# EAGLE schematic A33 MINI TABLET (EAGLE 9.6.2)
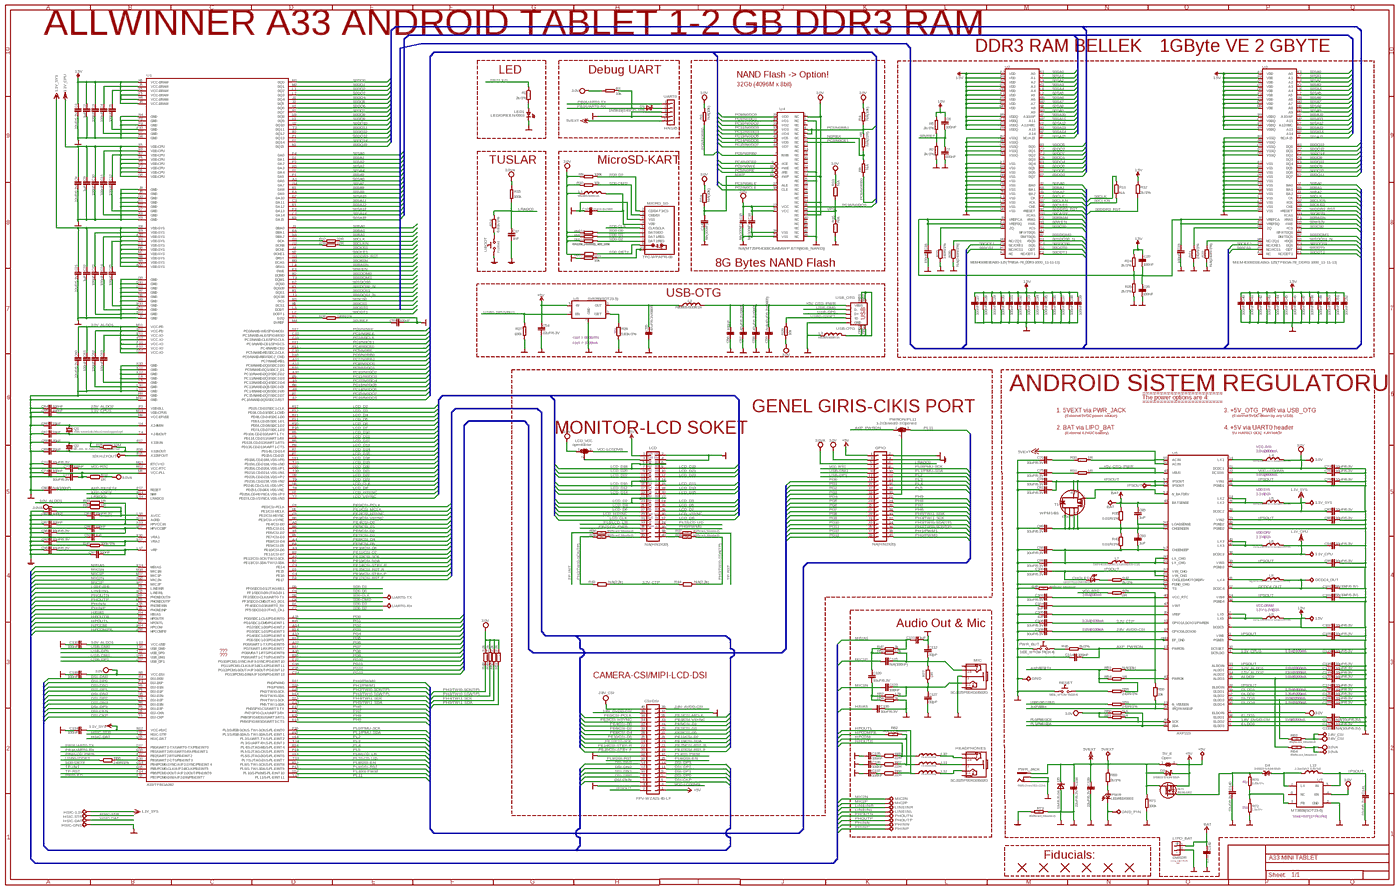
[diagram p0: schematic, sheet 1, overview]
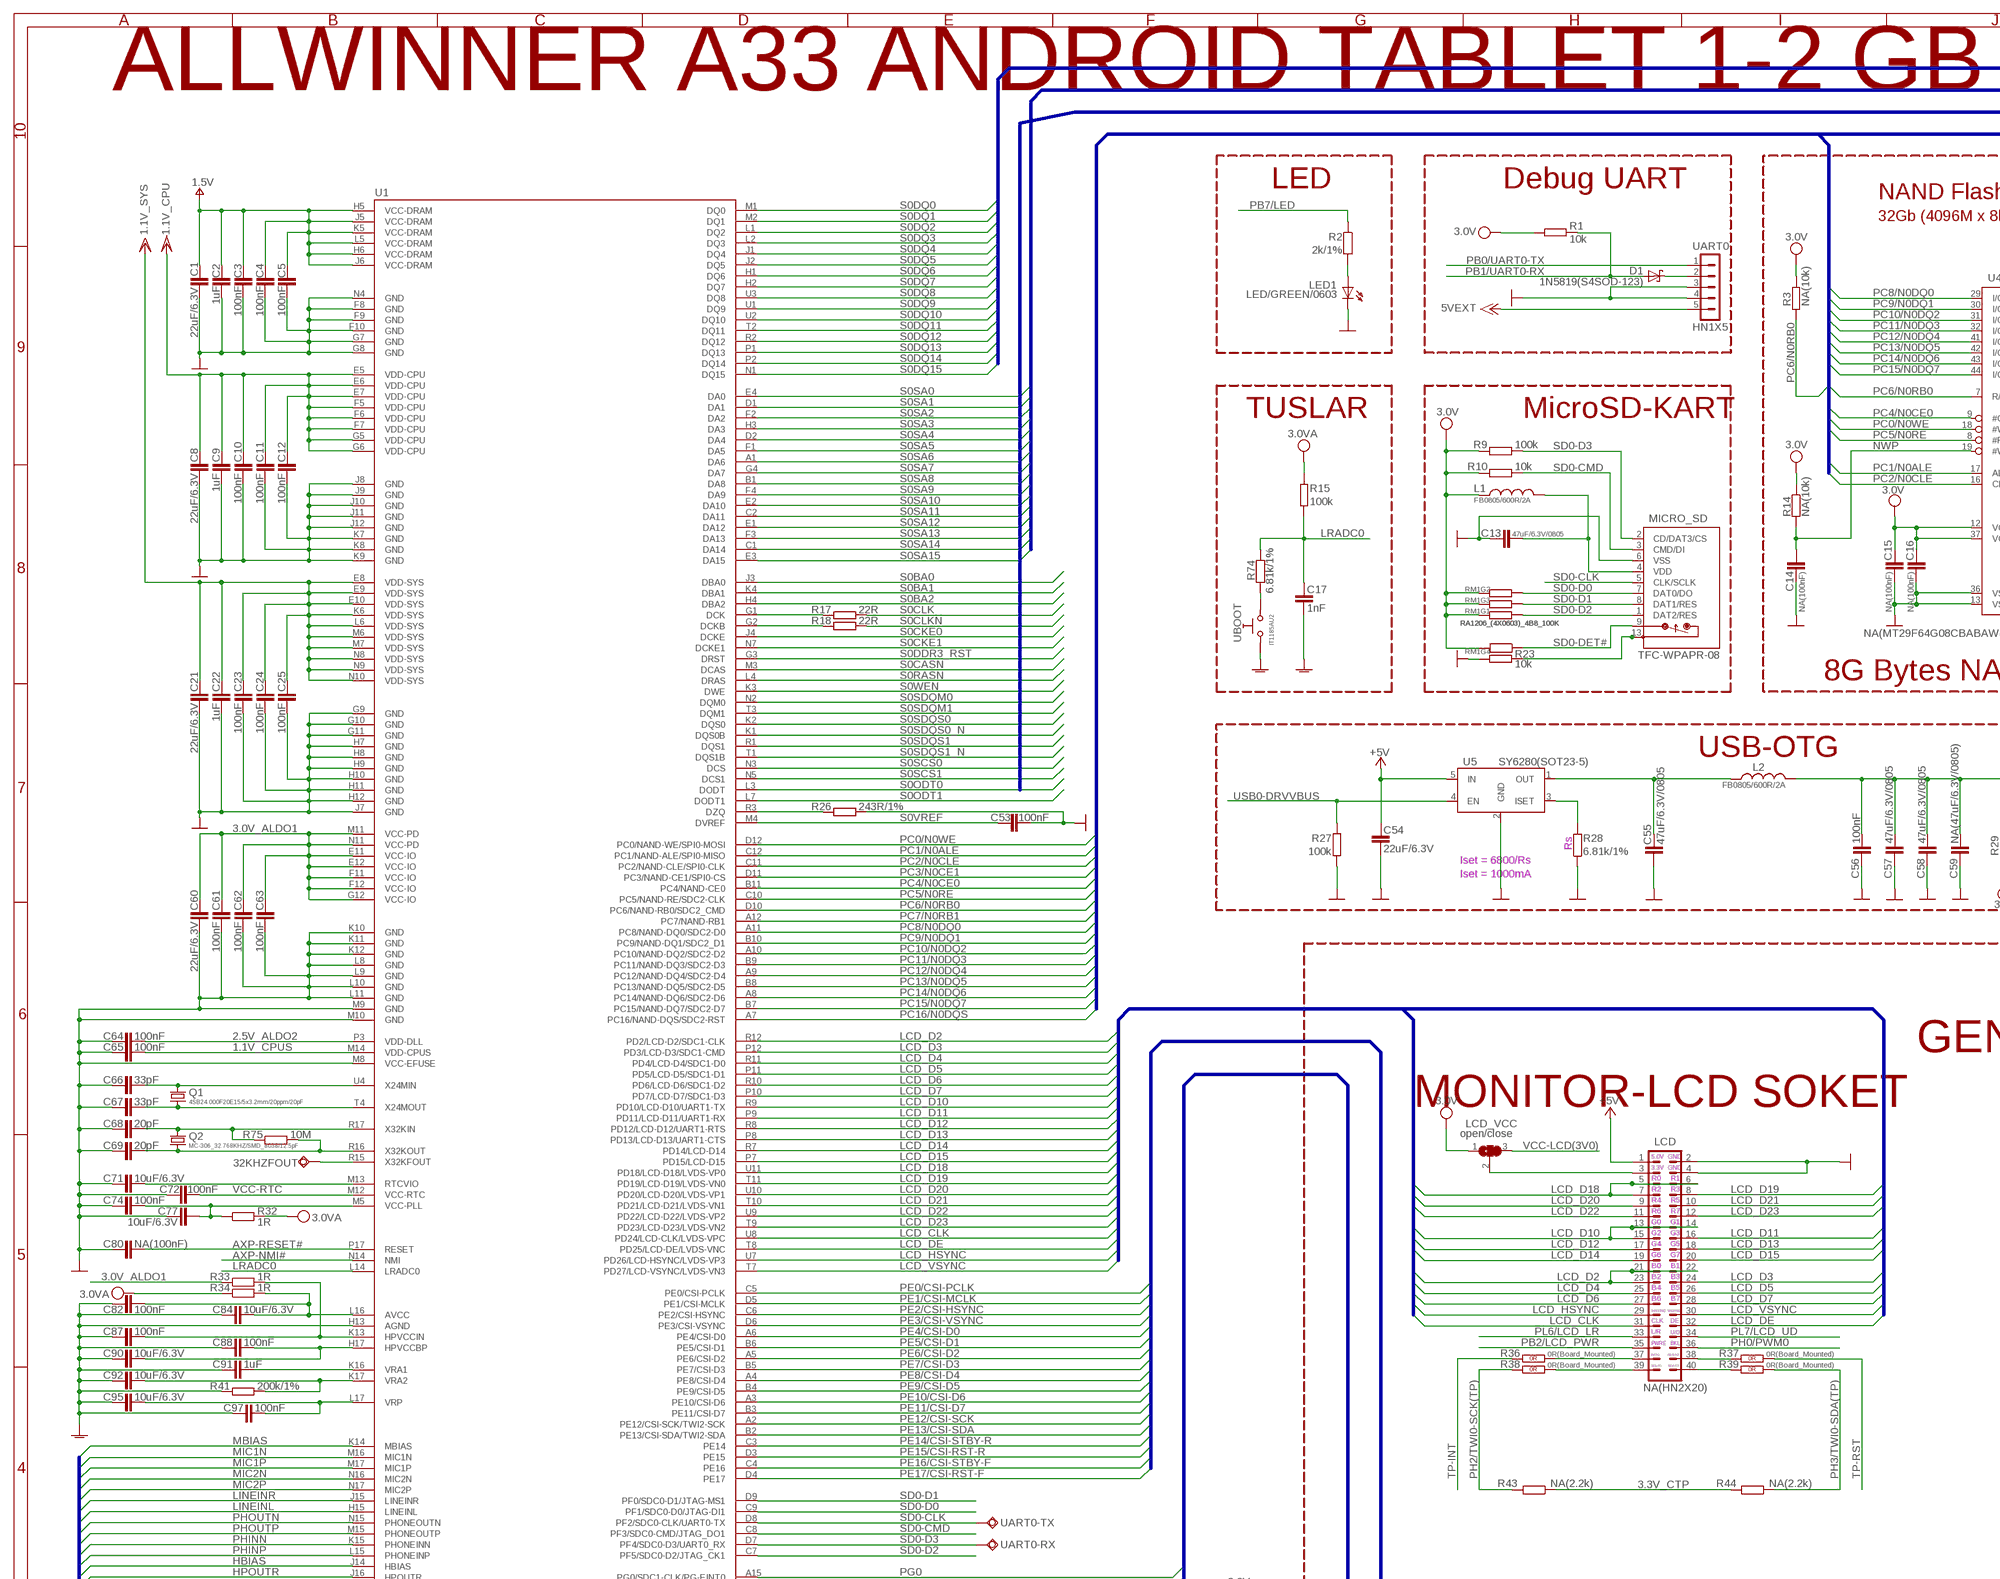
[diagram p1: schematic, sheet 1, part 1 of 4]
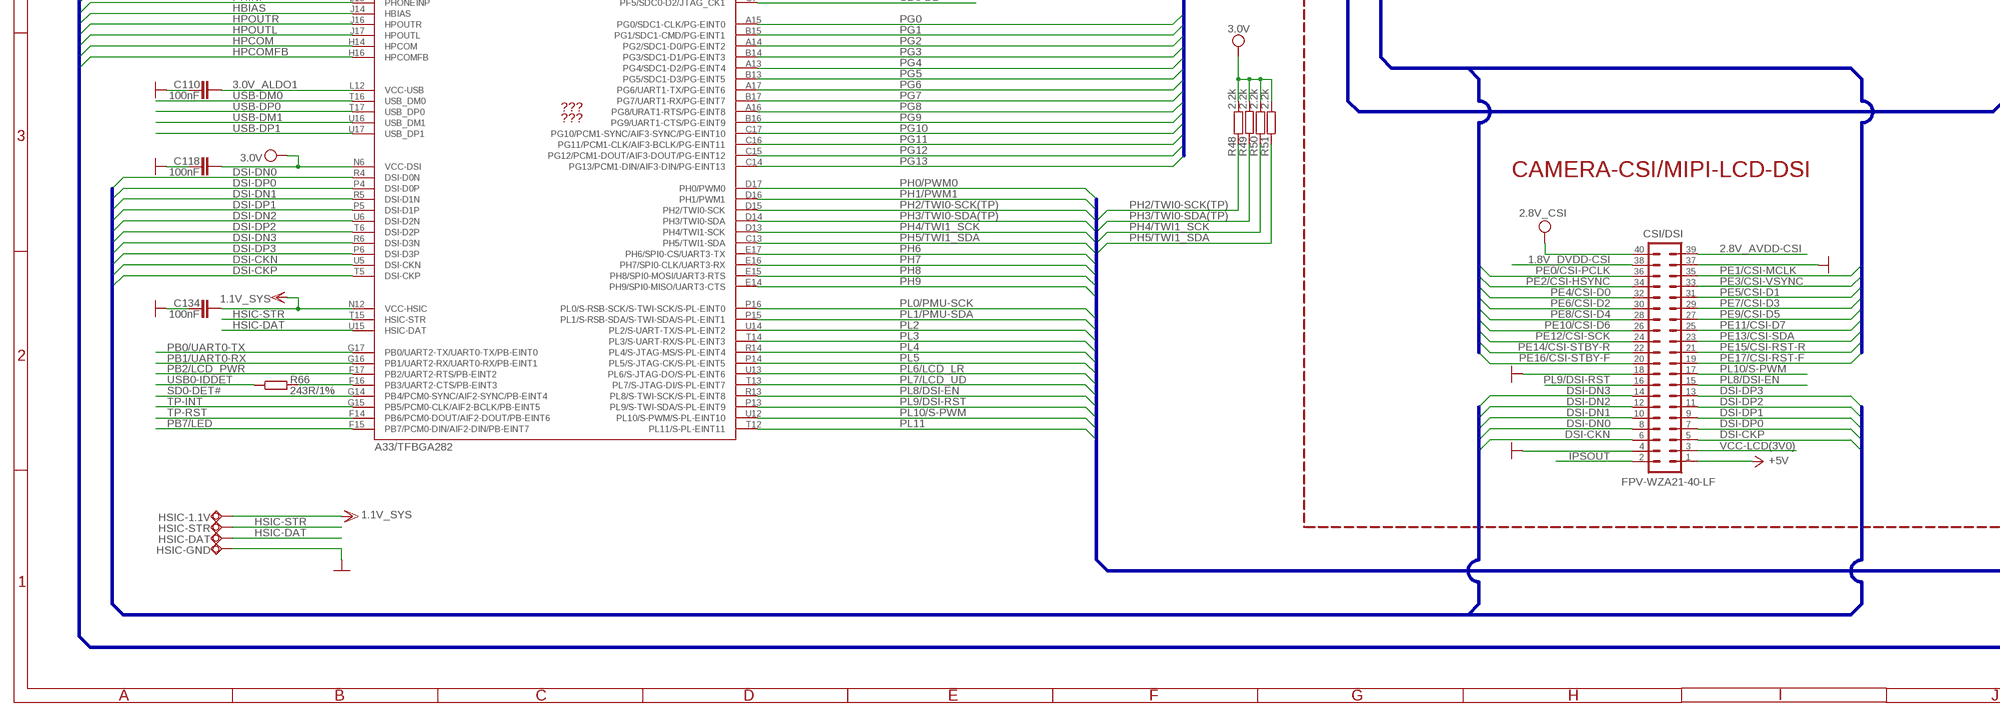
[diagram p2: schematic, sheet 1, part 2 of 4]
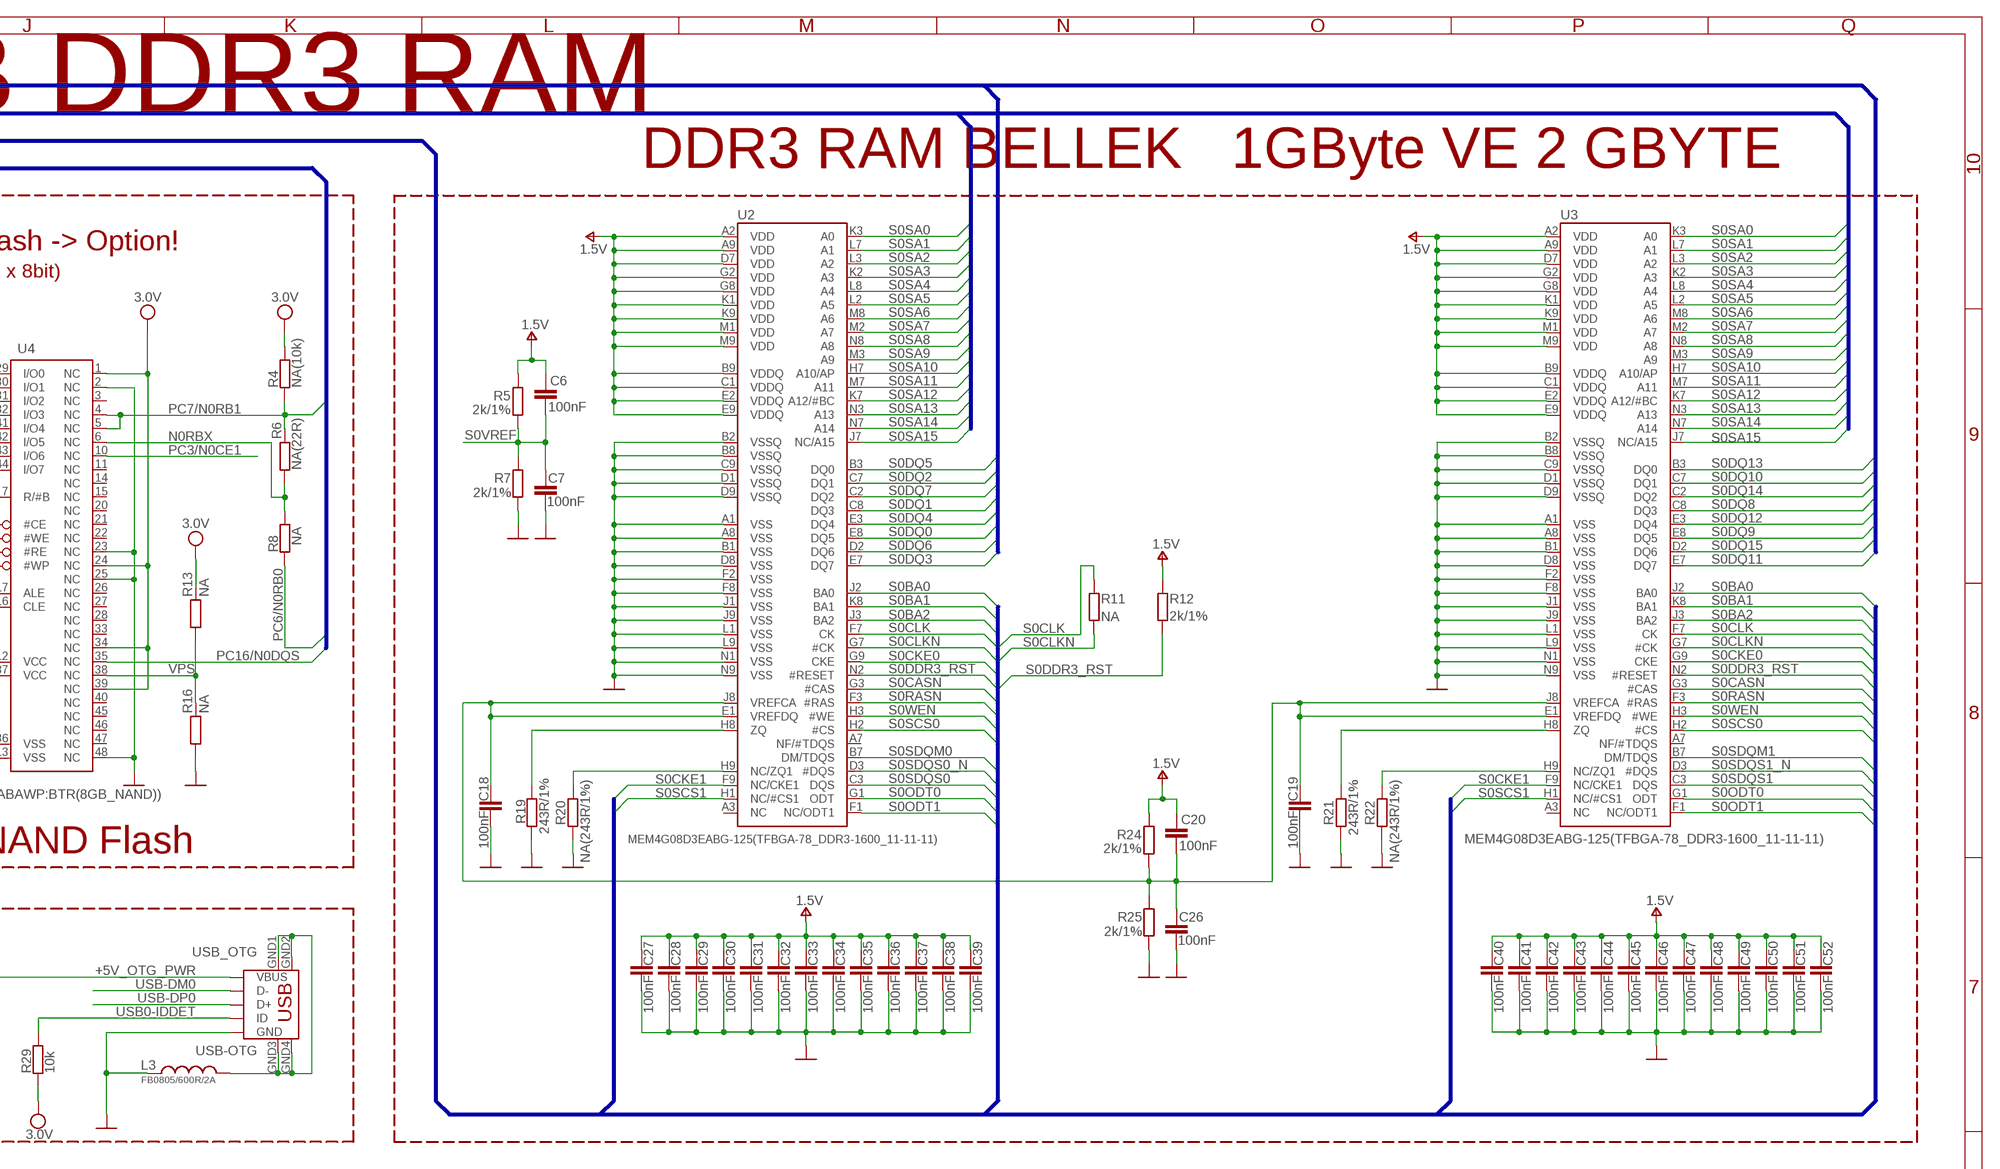
[diagram p3: schematic, sheet 1, part 3 of 4]
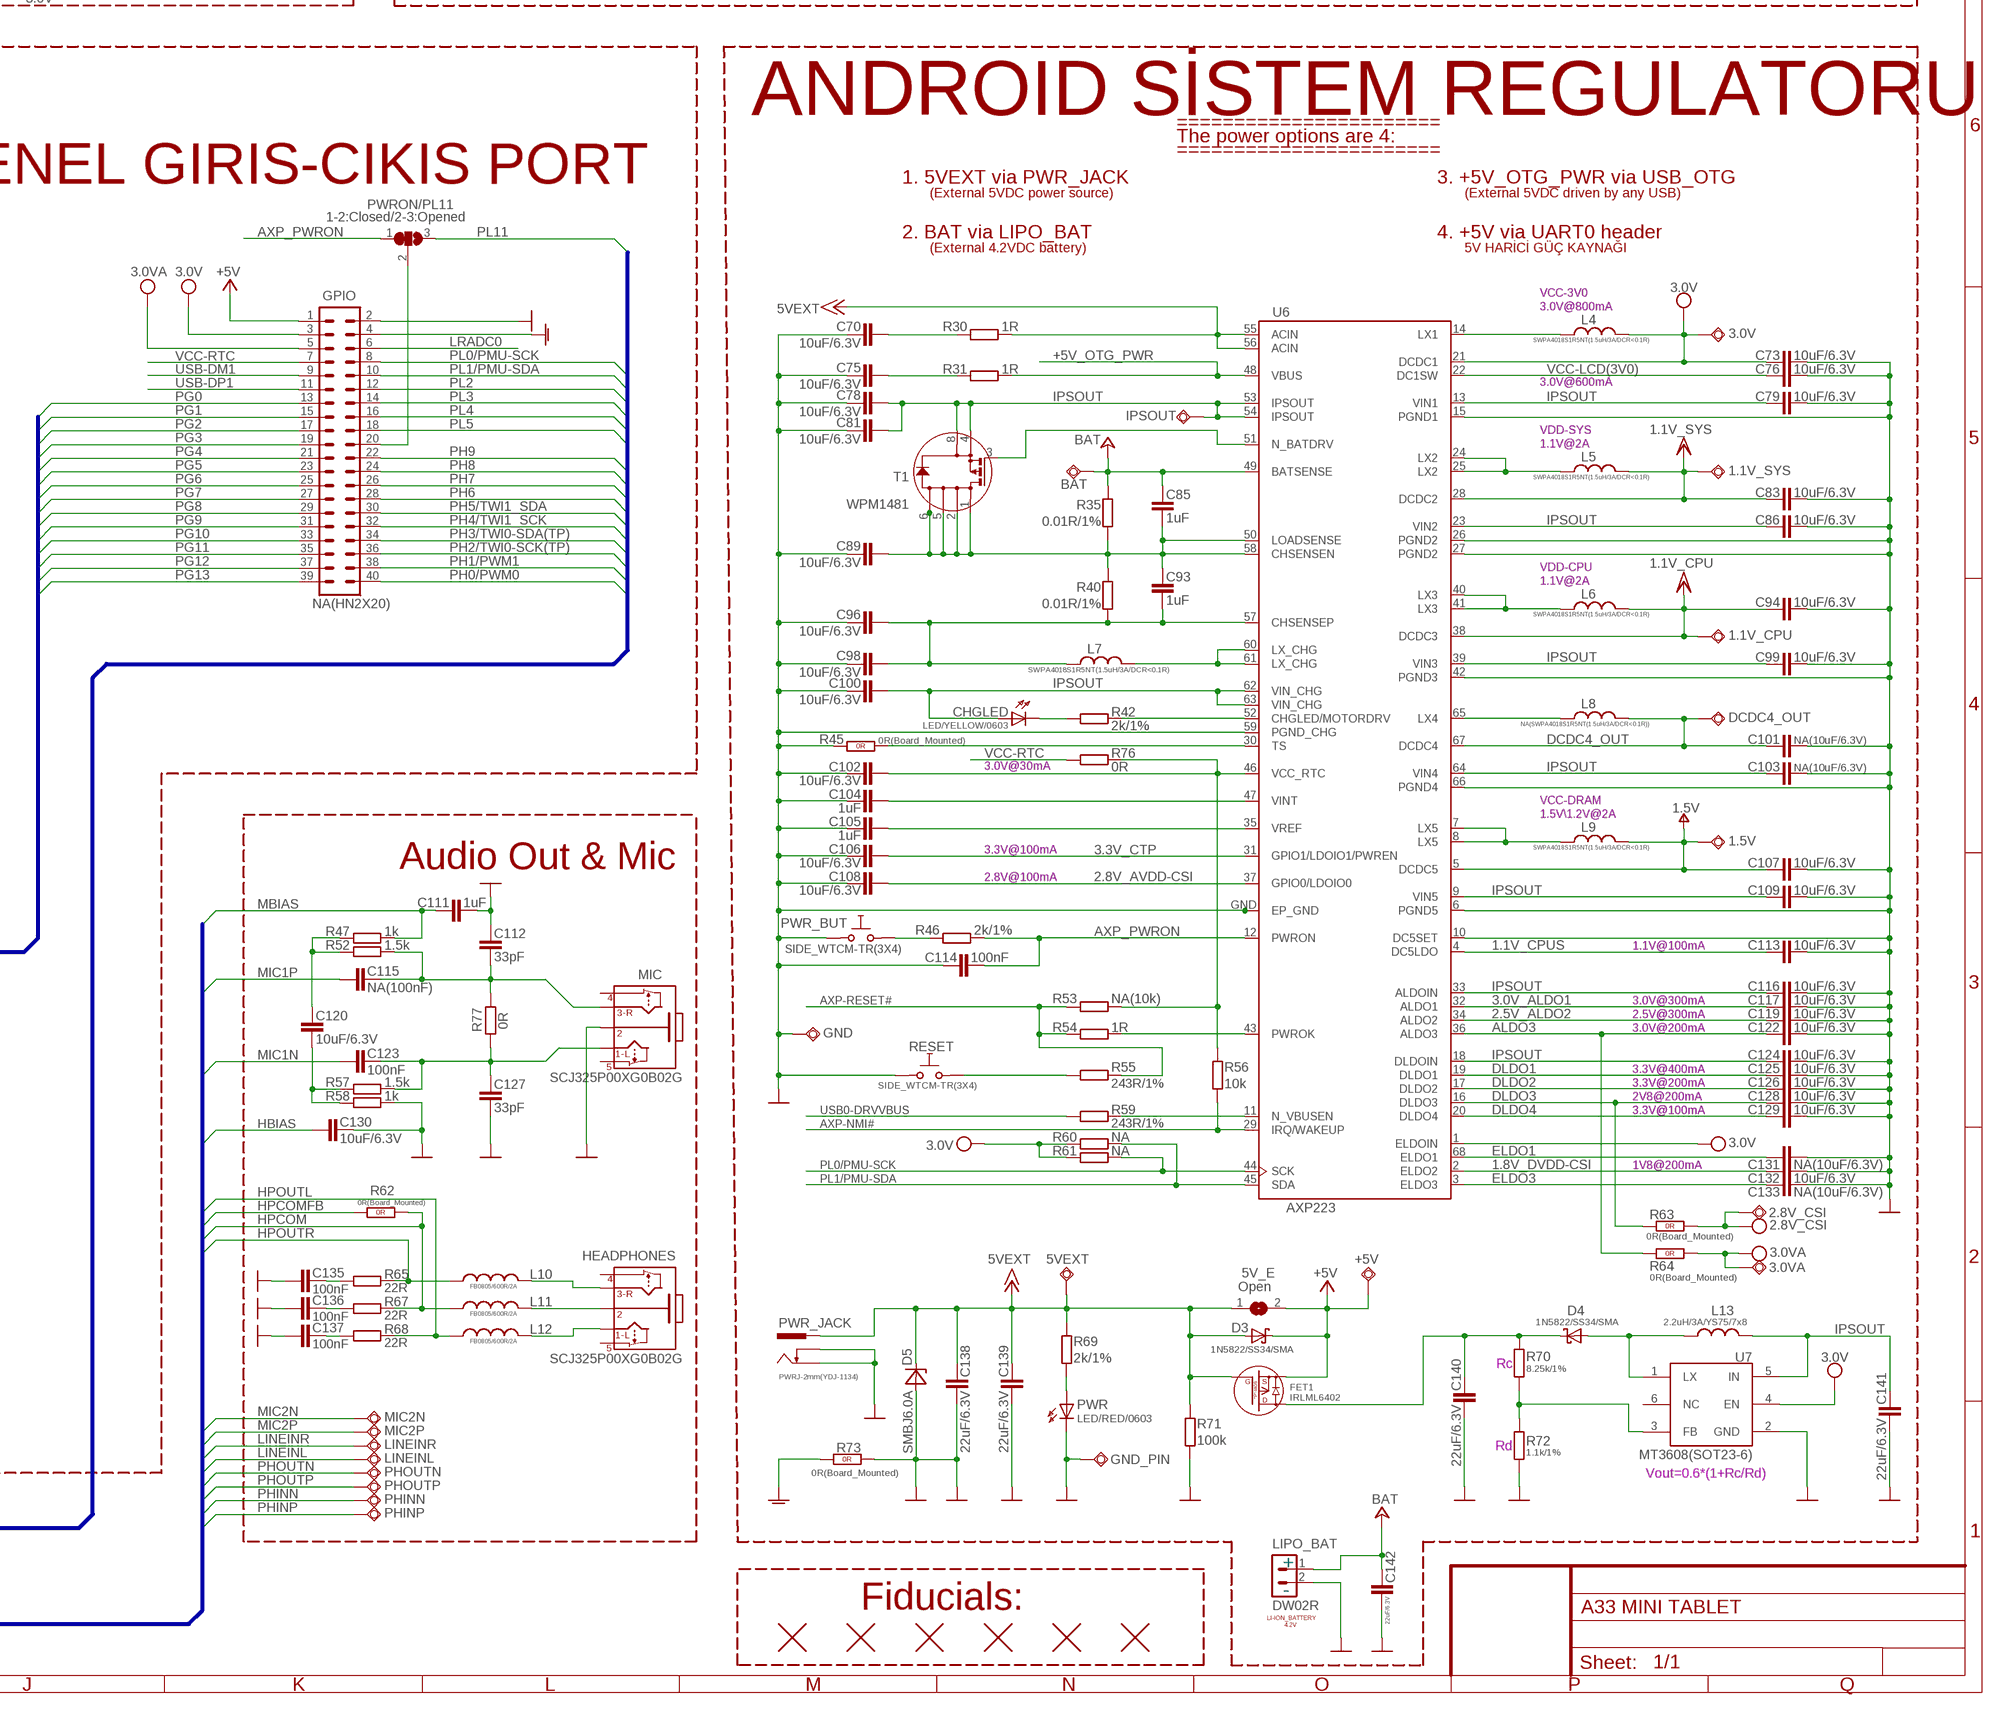
[diagram p4: schematic, sheet 1, part 4 of 4]

## Parts
1.1V_CPU  TESTPADTESTPAD_40-ROUND  [TESTPAD_40-ROUND]
1.1V_SYS  TESTPADTESTPAD_40-ROUND  [TESTPAD_40-ROUND]
1.5V  TESTPADTESTPAD_40-ROUND  [TESTPAD_40-ROUND]
2.8V_CSI  TESTPADTESTPAD_40-ROUND  [TESTPAD_40-ROUND]
3.0V  TESTPADTESTPAD_40-ROUND  [TESTPAD_40-ROUND]
3.0VA  TESTPADTESTPAD_40-ROUND  [TESTPAD_40-ROUND]
5V_E  Open  SJSJ_SMALLER  [SJ_1_SMALLER]
5VEXT  TESTPADTESTPAD_40-ROUND  [TESTPAD_40-ROUND]
32KHZFOUT  TESTPADTESTPAD_40-ROUND  [TESTPAD_40-ROUND]
+5V  TESTPADTESTPAD_40-ROUND  [TESTPAD_40-ROUND]
BAT  TESTPADTESTPAD_40-ROUND  [TESTPAD_40-ROUND]
C1  22uF/6.3V  C-EUC0603_DWS  [C0603_DWS]
C2  1uF  C-EUC0603_DWS  [C0603_DWS]
C3  100nF  C-EUC0402_TI  [C0402_TI]
C4  100nF  C-EUC0402_TI  [C0402_TI]
C5  100nF  C-EUC0402_TI  [C0402_TI]
C6  100nF  C-EUC0402_TI  [C0402_TI]
C7  100nF  C-EUC0402_TI  [C0402_TI]
C8  22uF/6.3V  C-EUC0603_DWS  [C0603_DWS]
C9  1uF  C-EUC0603_DWS  [C0603_DWS]
C10  100nF  C-EUC0402_TI  [C0402_TI]
C11  100nF  C-EUC0402_TI  [C0402_TI]
C12  100nF  C-EUC0402_TI  [C0402_TI]
C13  47uF/6.3V/0805  C-EUC0805_5MIL_DWS  [C0805_5MIL_DWS]
C14  NA(100nF)  C-EUC0402_TI  [C0402_TI]
C15  NA(100nF)  C-EUC0402_TI  [C0402_TI]
C16  NA(100nF)  C-EUC0402_TI  [C0402_TI]
C17  1nF  C-EUC0603_DWS  [C0603_DWS]
C18  100nF  C-EUC0402_TI  [C0402_TI]
C19  100nF  C-EUC0402_TI  [C0402_TI]
C20  100nF  C-EUC0402_TI  [C0402_TI]
C21  22uF/6.3V  C-EUC0603_DWS  [C0603_DWS]
C22  1uF  C-EUC0603_DWS  [C0603_DWS]
C23  100nF  C-EUC0402_TI  [C0402_TI]
C24  100nF  C-EUC0402_TI  [C0402_TI]
C25  100nF  C-EUC0402_TI  [C0402_TI]
C26  100nF  C-EUC0402_TI  [C0402_TI]
C27  100nF  C-EUC0402_TI  [C0402_TI]
C28  100nF  C-EUC0402_TI  [C0402_TI]
C29  100nF  C-EUC0402_TI  [C0402_TI]
C30  100nF  C-EUC0402_TI  [C0402_TI]
C31  100nF  C-EUC0402_TI  [C0402_TI]
C32  100nF  C-EUC0402_TI  [C0402_TI]
C33  100nF  C-EUC0402_TI  [C0402_TI]
C34  100nF  C-EUC0402_TI  [C0402_TI]
C35  100nF  C-EUC0402_TI  [C0402_TI]
C36  100nF  C-EUC0402_TI  [C0402_TI]
C37  100nF  C-EUC0402_TI  [C0402_TI]
C38  100nF  C-EUC0402_TI  [C0402_TI]
C39  100nF  C-EUC0402_TI  [C0402_TI]
C40  100nF  C-EUC0402_TI  [C0402_TI]
C41  100nF  C-EUC0402_TI  [C0402_TI]
C42  100nF  C-EUC0402_TI  [C0402_TI]
C43  100nF  C-EUC0402_TI  [C0402_TI]
C44  100nF  C-EUC0402_TI  [C0402_TI]
C45  100nF  C-EUC0402_TI  [C0402_TI]
C46  100nF  C-EUC0402_TI  [C0402_TI]
C47  100nF  C-EUC0402_TI  [C0402_TI]
C48  100nF  C-EUC0402_TI  [C0402_TI]
C49  100nF  C-EUC0402_TI  [C0402_TI]
C50  100nF  C-EUC0402_TI  [C0402_TI]
C51  100nF  C-EUC0402_TI  [C0402_TI]
C52  100nF  C-EUC0402_TI  [C0402_TI]
C53  100nF  C-EUC0402_TI  [C0402_TI]
C54  22uF/6.3V  C-EUC0603_DWS  [C0603_DWS]
C55  47uF/6.3V/0805  C-EUC0805_5MIL_DWS  [C0805_5MIL_DWS]
C56  100nF  C-EUC0402_TI  [C0402_TI]
C57  47uF/6.3V/0805  C-EUC0805_5MIL_DWS  [C0805_5MIL_DWS]
C58  47uF/6.3V/0805  C-EUC0805_5MIL_DWS  [C0805_5MIL_DWS]
C59  NA(47uF/6.3V/0805)  C-EUC0805_5MIL_DWS  [C0805_5MIL_DWS]
C60  22uF/6.3V  C-EUC0603_DWS  [C0603_DWS]
C61  100nF  C-EUC0402_TI  [C0402_TI]
C62  100nF  C-EUC0402_TI  [C0402_TI]
C63  100nF  C-EUC0402_TI  [C0402_TI]
C64  100nF  C-EUC0402_TI  [C0402_TI]
C65  100nF  C-EUC0402_TI  [C0402_TI]
C66  33pF  C-EUC0603_DWS  [C0603_DWS]
C67  33pF  C-EUC0603_DWS  [C0603_DWS]
C68  20pF  C-EUC0603_DWS  [C0603_DWS]
C69  20pF  C-EUC0603_DWS  [C0603_DWS]
C70  10uF/6.3V  C-EUC0603_DWS  [C0603_DWS]
C71  10uF/6.3V  C-EUC0603_DWS  [C0603_DWS]
C72  100nF  C-EUC0402_TI  [C0402_TI]
C73  10uF/6.3V  C-EUC0603_DWS  [C0603_DWS]
C74  100nF  C-EUC0402_TI  [C0402_TI]
C75  10uF/6.3V  C-EUC0603_DWS  [C0603_DWS]
C76  10uF/6.3V  C-EUC0603_DWS  [C0603_DWS]
C77  10uF/6.3V  C-EUC0603_DWS  [C0603_DWS]
C78  10uF/6.3V  C-EUC0603_DWS  [C0603_DWS]
C79  10uF/6.3V  C-EUC0603_DWS  [C0603_DWS]
C80  NA(100nF)  C-EUC0402_TI  [C0402_TI]
C81  10uF/6.3V  C-EUC0603_DWS  [C0603_DWS]
C82  100nF  C-EUC0402_TI  [C0402_TI]
C83  10uF/6.3V  C-EUC0603_DWS  [C0603_DWS]
C84  10uF/6.3V  C-EUC0603_DWS  [C0603_DWS]
C85  1uF  C-EUC0603_DWS  [C0603_DWS]
C86  10uF/6.3V  C-EUC0603_DWS  [C0603_DWS]
C87  100nF  C-EUC0402_TI  [C0402_TI]
C88  100nF  C-EUC0402_TI  [C0402_TI]
C89  10uF/6.3V  C-EUC0603_DWS  [C0603_DWS]
C90  10uF/6.3V  C-EUC0603_DWS  [C0603_DWS]
C91  1uF  C-EUC0603_DWS  [C0603_DWS]
C92  10uF/6.3V  C-EUC0603_DWS  [C0603_DWS]
C93  1uF  C-EUC0603_DWS  [C0603_DWS]
C94  10uF/6.3V  C-EUC0603_DWS  [C0603_DWS]
C95  10uF/6.3V  C-EUC0603_DWS  [C0603_DWS]
C96  10uF/6.3V  C-EUC0603_DWS  [C0603_DWS]
C97  100nF  C-EUC0402_TI  [C0402_TI]
C98  10uF/6.3V  C-EUC0603_DWS  [C0603_DWS]
C99  10uF/6.3V  C-EUC0603_DWS  [C0603_DWS]
C100  10uF/6.3V  C-EUC0603_DWS  [C0603_DWS]
C101  NA(10uF/6.3V)  C-EUC0603_DWS  [C0603_DWS]
C102  10uF/6.3V  C-EUC0603_DWS  [C0603_DWS]
C103  NA(10uF/6.3V)  C-EUC0603_DWS  [C0603_DWS]
C104  1uF  C-EUC0603_DWS  [C0603_DWS]
C105  1uF  C-EUC0603_DWS  [C0603_DWS]
C106  10uF/6.3V  C-EUC0603_DWS  [C0603_DWS]
C107  10uF/6.3V  C-EUC0603_DWS  [C0603_DWS]
C108  10uF/6.3V  C-EUC0603_DWS  [C0603_DWS]
C109  10uF/6.3V  C-EUC0603_DWS  [C0603_DWS]
C110  100nF  C-EUC0402_TI  [C0402_TI]
C111  1uF  C-EUC0603_DWS  [C0603_DWS]
C112  33pF  C-EUC0603_DWS  [C0603_DWS]
C113  10uF/6.3V  C-EUC0603_DWS  [C0603_DWS]
C114  100nF  C-EUC0402_TI  [C0402_TI]
C115  NA(100nF)  C-EUC0402_TI  [C0402_TI]
C116  10uF/6.3V  C-EUC0603_DWS  [C0603_DWS]
C117  10uF/6.3V  C-EUC0603_DWS  [C0603_DWS]
C118  100nF  C-EUC0402_TI  [C0402_TI]
C119  10uF/6.3V  C-EUC0603_DWS  [C0603_DWS]
C120  10uF/6.3V  C-EUC0603_DWS  [C0603_DWS]
C122  10uF/6.3V  C-EUC0603_DWS  [C0603_DWS]
C123  100nF  C-EUC0402_TI  [C0402_TI]
C124  10uF/6.3V  C-EUC0603_DWS  [C0603_DWS]
C125  10uF/6.3V  C-EUC0603_DWS  [C0603_DWS]
C126  10uF/6.3V  C-EUC0603_DWS  [C0603_DWS]
C127  33pF  C-EUC0603_DWS  [C0603_DWS]
C128  10uF/6.3V  C-EUC0603_DWS  [C0603_DWS]
C129  10uF/6.3V  C-EUC0603_DWS  [C0603_DWS]
C130  10uF/6.3V  C-EUC0603_DWS  [C0603_DWS]
C131  NA(10uF/6.3V)  C-EUC0603_DWS  [C0603_DWS]
C132  10uF/6.3V  C-EUC0603_DWS  [C0603_DWS]
C133  NA(10uF/6.3V)  C-EUC0603_DWS  [C0603_DWS]
C134  100nF  C-EUC0402_TI  [C0402_TI]
C135  100nF  C-EUC0402_TI  [C0402_TI]
C136  100nF  C-EUC0402_TI  [C0402_TI]
C137  100nF  C-EUC0402_TI  [C0402_TI]
C138  22uF/6.3V  C-EUC0603_DWS  [C0603_DWS]
C139  22uF/6.3V  C-EUC0603_DWS  [C0603_DWS]
C140  22uF/6.3V  C-EUC0603_DWS  [C0603_DWS]
C141  22uF/6.3V  C-EUC0603_DWS  [C0603_DWS]
C142  22uF/6.3V  C-EUC0603_DWS  [C0603_DWS]
CHGLED  LED/YELLOW/0603  LEDLED-0603_TEST  [LED-0603_TEST]
CSI/DSI  FPV-WZA21-40-LF  ML40-FPV-WZA21-40-LF  [FPV-WZA21-40-LF]
D1  1N5819(S4SOD-123)  SCHOTKKY7.62SS-1N5819(S4SOD-123)  [SOD-123]
D3  1N5822/SS34/SMA  SCHOTKKY7.62SS2  [MLL-41]
D4  1N5822/SS34/SMA  SCHOTKKY7.62SS2  [MLL-41]
D5  SMBJ6.0A  SMBJ16A  [DO214AA]
DCDC4_OUT  TESTPADTESTPAD_40-ROUND  [TESTPAD_40-ROUND]
FET1  IRLML6402  P-MOS+DIODIRLML6402  [SOT23]
GND  TESTPADTESTPAD_40-ROUND  [TESTPAD_40-ROUND]
GND_PIN  TESTPAD3  [TEST_PAD40/70/SQUARE]
GPIO  NA(HN2X20)  ML40HN2X20  [HN2X20-MALE]
HEADPHONES  SCJ325P00XG0B02G  AUDIO_JACK_3-5PIN  [SCJ325P00XG0B02G]
HSIC-1.1V  TESTPADTESTPAD_40-ROUND  [TESTPAD_40-ROUND]
HSIC-DAT  TESTPADTESTPAD_40-ROUND  [TESTPAD_40-ROUND]
HSIC-GND  TESTPADTESTPAD_40-ROUND  [TESTPAD_40-ROUND]
HSIC-STR  TESTPADTESTPAD_40-ROUND  [TESTPAD_40-ROUND]
IPSOUT  TESTPADTESTPAD_40-ROUND  [TESTPAD_40-ROUND]
L1  FB0805/600R/2A  L-USL0805_5MIL_DWS  [L0805_5MIL_DWS]
L2  FB0805/600R/2A  L-USL0805_5MIL_DWS  [L0805_5MIL_DWS]
L3  FB0805/600R/2A  L-USL0805_5MIL_DWS  [L0805_5MIL_DWS]
L4  SWPA4018S1R5NT(1.5uH/3A/DCR<0.1R)  L-SWPA4018S  [SWPA4018S]
L5  SWPA4018S1R5NT(1.5uH/3A/DCR<0.1R)  L-SWPA4018S  [SWPA4018S]
L6  SWPA4018S1R5NT(1.5uH/3A/DCR<0.1R)  L-SWPA4018S  [SWPA4018S]
L7  SWPA4018S1R5NT(1.5uH/3A/DCR<0.1R)  L-SWPA4018S  [SWPA4018S]
L8  NA(SWPA4018S1R5NT(1.5uH/3A/DCR<0.1R))  L-SWPA4018S  [SWPA4018S]
L9  SWPA4018S1R5NT(1.5uH/3A/DCR<0.1R)  L-SWPA4018S  [SWPA4018S]
L10  FB0805/600R/2A  L-USL0805_5MIL_DWS  [L0805_5MIL_DWS]
L11  FB0805/600R/2A  L-USL0805_5MIL_DWS  [L0805_5MIL_DWS]
L12  FB0805/600R/2A  L-USL0805_5MIL_DWS  [L0805_5MIL_DWS]
L13  2.2uH/3A/YS75/7x8  LLQH88PN100M38  [8X8MM_3131]
LCD  NA(HN2X20)  ML40HN2X20  [HN2X20-MALE]
LCD_VCC  open/close  SJ2W5  [SJ_2_SMALL_23_TIED]
LED1  LED/GREEN/0603  LEDLED-0603_TEST  [LED-0603_TEST]
LINEINL  TESTPADTESTPAD_40-ROUND  [TESTPAD_40-ROUND]
LINEINR  TESTPADTESTPAD_40-ROUND  [TESTPAD_40-ROUND]
LIPO_BAT  DW02R  CON2DW02R  [DW02R]
MIC  SCJ325P00XG0B02G  AUDIO_JACK_3-5PIN  [SCJ325P00XG0B02G]
MIC2N  TESTPADTESTPAD_40-ROUND  [TESTPAD_40-ROUND]
MIC2P  TESTPADTESTPAD_40-ROUND  [TESTPAD_40-ROUND]
MICRO_SD  TFC-WPAPR-08  MICRO_SD/MMC_CP_NEWTFC-WPAPR-08  [TFC-WPAPR-08]
PHINN  TESTPADTESTPAD_40-ROUND  [TESTPAD_40-ROUND]
PHINP  TESTPADTESTPAD_40-ROUND  [TESTPAD_40-ROUND]
PHOUTN  TESTPADTESTPAD_40-ROUND  [TESTPAD_40-ROUND]
PHOUTP  TESTPADTESTPAD_40-ROUND  [TESTPAD_40-ROUND]
PWR  LED/RED/0603  LEDLED-0603_TEST  [LED-0603_TEST]
PWR_BUT  SIDE_WTCM-TR(3X4)  SW-TAKTSIDE_WTCM-TR(3X4)  [SW_TAKT3X4]
PWR_JACK  PWRJ-2mm(YDJ-1134)  PWR-JAKPWR_JACK_UNI_MILLING  [PWR_JACK_UNI_MILLING]
PWRON/PL11  1-2:Closed/2-3:Opened  SJ2W6  [SJ_2_SMALL_12_TIED]
Q1  4SB24.000F20E15/5x3.2mm/20ppm/20pF  HC49/S_E4SB25.000F20E15  [HCX-4S]
Q2  MC-306_32.768KHZ/SMD_8038/12.5pF  HC49/S_32768HZ/6PF  [MC-306]
R1  10k  R-EU_R0603_5MIL_DWS  [R0603_5MIL_DWS]
R2  2k/1%  R-EU_R0603_5MIL_DWS  [R0603_5MIL_DWS]
R3  NA(10k)  R-EU_R0603_5MIL_DWS  [R0603_5MIL_DWS]
R4  NA(10k)  R-EU_R0603_5MIL_DWS  [R0603_5MIL_DWS]
R5  2k/1%  R-EU_R0603_5MIL_DWS  [R0603_5MIL_DWS]
R6  NA(22R)  R-EU_R0402_TI  [R0402_TI]
R7  2k/1%  R-EU_R0603_5MIL_DWS  [R0603_5MIL_DWS]
R8  NA  R-EU_R0603_5MIL_DWS  [R0603_5MIL_DWS]
R9  100k  R-EU_R0603_5MIL_DWS  [R0603_5MIL_DWS]
R10  10k  R-EU_R0603_5MIL_DWS  [R0603_5MIL_DWS]
R11  NA  R-EU_R0402_TI  [R0402_TI]
R12  2k/1%  R-EU_R0603_5MIL_DWS  [R0603_5MIL_DWS]
R13  NA  R-EU_R0603_5MIL_DWS  [R0603_5MIL_DWS]
R14  NA(10k)  R-EU_R0603_5MIL_DWS  [R0603_5MIL_DWS]
R15  100k  R-EU_R0603_5MIL_DWS  [R0603_5MIL_DWS]
R16  NA  R-EU_R0603_5MIL_DWS  [R0603_5MIL_DWS]
R17  22R  R-EU_R0402_TI  [R0402_TI]
R18  22R  R-EU_R0402_TI  [R0402_TI]
R19  243R/1%  R-EU_R0603_5MIL_DWS  [R0603_5MIL_DWS]
R20  NA(243R/1%)  R-EU_R0603_5MIL_DWS  [R0603_5MIL_DWS]
R21  243R/1%  R-EU_R0603_5MIL_DWS  [R0603_5MIL_DWS]
R22  NA(243R/1%)  R-EU_R0603_5MIL_DWS  [R0603_5MIL_DWS]
R23  10k  R-EU_R0603_5MIL_DWS  [R0603_5MIL_DWS]
R24  2k/1%  R-EU_R0603_5MIL_DWS  [R0603_5MIL_DWS]
R25  2k/1%  R-EU_R0603_5MIL_DWS  [R0603_5MIL_DWS]
R26  243R/1%  R-EU_R0603_5MIL_DWS  [R0603_5MIL_DWS]
R27  100k  R-EU_R0603_5MIL_DWS  [R0603_5MIL_DWS]
R28  6.81k/1%  R-EU_R0603_5MIL_DWS  [R0603_5MIL_DWS]
R29  10k  R-EU_R0603_5MIL_DWS  [R0603_5MIL_DWS]
R30  1R  R-EU_R0603_5MIL_DWS  [R0603_5MIL_DWS]
R31  1R  R-EU_R0603_5MIL_DWS  [R0603_5MIL_DWS]
R32  1R  R-EU_R0603_5MIL_DWS  [R0603_5MIL_DWS]
R33  1R  R-EU_R0603_5MIL_DWS  [R0603_5MIL_DWS]
R34  1R  R-EU_R0603_5MIL_DWS  [R0603_5MIL_DWS]
R35  0.01R/1%  R-EU_R1206_5MIL_WS  [R1206_5MIL_WS]
R36  0R(Board_Mounted)  R_0R0R(NA)  [0603_0R]
R37  0R(Board_Mounted)  R_0R0R(NA)  [0603_0R]
R38  0R(Board_Mounted)  R_0R0R(NA)  [0603_0R]
R39  0R(Board_Mounted)  R_0R0R(NA)  [0603_0R]
R40  0.01R/1%  R-EU_R1206_5MIL_WS  [R1206_5MIL_WS]
R41  200k/1%  R-EU_R0603_5MIL_DWS  [R0603_5MIL_DWS]
R42  2k/1%  R-EU_R0603_5MIL_DWS  [R0603_5MIL_DWS]
R43  NA(2.2k)  R-EU_R0603_5MIL_DWS  [R0603_5MIL_DWS]
R44  NA(2.2k)  R-EU_R0603_5MIL_DWS  [R0603_5MIL_DWS]
R45  0R(Board_Mounted)  R_0R0R(NA)  [0603_0R]
R46  2k/1%  R-EU_R0603_5MIL_DWS  [R0603_5MIL_DWS]
R47  1k  R-EU_R0603_5MIL_DWS  [R0603_5MIL_DWS]
R48  2.2k  R-EU_R0603_5MIL_DWS  [R0603_5MIL_DWS]
R49  2.2k  R-EU_R0603_5MIL_DWS  [R0603_5MIL_DWS]
R50  2.2k  R-EU_R0603_5MIL_DWS  [R0603_5MIL_DWS]
R51  2.2k  R-EU_R0603_5MIL_DWS  [R0603_5MIL_DWS]
R52  1.5k  R-EU_R0603_5MIL_DWS  [R0603_5MIL_DWS]
R53  NA(10k)  R-EU_R0603_5MIL_DWS  [R0603_5MIL_DWS]
R54  1R  R-EU_R0603_5MIL_DWS  [R0603_5MIL_DWS]
R55  243R/1%  R-EU_R0603_5MIL_DWS  [R0603_5MIL_DWS]
R56  10k  R-EU_R0603_5MIL_DWS  [R0603_5MIL_DWS]
R57  1.5k  R-EU_R0603_5MIL_DWS  [R0603_5MIL_DWS]
R58  1k  R-EU_R0603_5MIL_DWS  [R0603_5MIL_DWS]
R59  243R/1%  R-EU_R0603_5MIL_DWS  [R0603_5MIL_DWS]
R60  NA  R-EU_R0603_5MIL_DWS  [R0603_5MIL_DWS]
R61  NA  R-EU_R0603_5MIL_DWS  [R0603_5MIL_DWS]
R62  0R(Board_Mounted)  R_0R0R(NA)  [0603_0R]
R63  0R(Board_Mounted)  R_0R0R(NA)  [0603_0R]
R64  0R(Board_Mounted)  R_0R0R(NA)  [0603_0R]
R65  22R  R-EU_R0402_TI  [R0402_TI]
R66  243R/1%  R-EU_R0603_5MIL_DWS  [R0603_5MIL_DWS]
R67  22R  R-EU_R0402_TI  [R0402_TI]
R68  22R  R-EU_R0402_TI  [R0402_TI]
R69  2k/1%  R-EU_R0603_5MIL_DWS  [R0603_5MIL_DWS]
R70  8.25k/1%  R-EU_R0603_5MIL_DWS  [R0603_5MIL_DWS]
R71  100k  R-EU_R0603_5MIL_DWS  [R0603_5MIL_DWS]
R72  1.1k/1%  R-EU_R0603_5MIL_DWS  [R0603_5MIL_DWS]
R73  0R(Board_Mounted)  R_0R0R(NA)  [0603_0R]
R74  6.81k/1%  R-EU_R0603_5MIL_DWS  [R0603_5MIL_DWS]
R75  10M  R-EU_R0402_SMALL  [R0402_SMALL]
R76  0R  R-EU_R1206_5MIL  [R1206_5MIL]
R77  0R  R-EU_R0603_5MIL_DWS  [R0603_5MIL_DWS]
RESET  SIDE_WTCM-TR(3X4)  SW-TAKTSIDE_WTCM-TR(3X4)  [SW_TAKT3X4]
RM1  RA1206_(4X0603)_4B8_100K  R_MATRIX_4E  [R_MATRIX_4]
T1  WPM1481  [DFN2*2-6L]
U1  A33/TFBGA282  [TFBGA282]
U2  MEM4G08D3EABG-125(TFBGA-78_DDR3-1600_11-11-11)  H5TQ2G83CFR-H9C  [FBGA78]
U3  MEM4G08D3EABG-125(TFBGA-78_DDR3-1600_11-11-11)  H5TQ2G83CFR-H9C  [FBGA78]
U4  NA(MT29F64G08CBABAWP:BTR(8GB_NAND))  H27UBG8T2A  [TSOP48]
U5  SY6280(SOT23-5)  SY6280  [SOT23-5]
U6  AXP223  AXP221  [QFN68-8X8-04]
U7  MT3608(SOT23-6)  SY7208  [SOT23-6]
U8  FIDUCIAL  [FIDUCIAL-1X3]
U9  FIDUCIAL  [FIDUCIAL-1X3]
U10  FIDUCIAL  [FIDUCIAL-1X3]
U11  FIDUCIAL  [FIDUCIAL-1X3]
U12  FIDUCIAL  [FIDUCIAL-1X3]
U13  FIDUCIAL  [FIDUCIAL-1X3]
UART0  HN1X5  CON5HN1X5  [HN1X5]
UART0-RX  TESTPADTESTPAD_40-ROUND  [TESTPAD_40-ROUND]
UART0-TX  TESTPADTESTPAD_40-ROUND  [TESTPAD_40-ROUND]
UBOOT  IT1185AU2  SW-TAKTIT1185AU2  [IT1185AU2]
USB_OTG  USB-OTG  MINI_USB9  [USB_MINI_9PIN]

## Nets
1.1V_CPUS: C65.2 C113.2 U1.M14(VDD-CPUS) U6.4(DC5LDO)
1.8V_DVDD-CSI: C132.2 CSI/DSI.38 U6.2(ELDO2)
2.5V_ALDO2: C64.2 C119.2 U1.P3(VDD-DLL) U6.34(ALDO2)
2.8V_AVDD-CSI: C108.2 CSI/DSI.39 U6.37(GPIO0/LDOIO0)
3.0V_ALDO1: C60.1 C61.2 C62.2 C63.2 C110.2 C117.2 R33.1 U1.E11(VCC-IO) U1.E12(VCC-IO) U1.F11(VCC-IO) U1.F12(VCC-IO) U1.G12(VCC-IO) U1.L12(VCC-USB) U1.M11(VCC-PD) U1.N11(VCC-PD) U6.32(ALDO1)
3.3V_CTP: C106.2 R43.1 R44.2 U6.31(GPIO1/LDOIO1/PWREN)
+5V: 5V_E.2 +5V.1(PP) C54.1 CSI/DSI.1 D3.K(C) FET1.2(S) GPIO.1 LCD.1 U5.5(IN)
+5V_OTG_PWR: C56.1 C57.1 C58.1 C59.1 L2.1 R31.2 U6.48(VBUS) USB_OTG.VBUS
+15V: 5V_E.1 5VEXT.1(PP) C138.1 C139.1 D3.A D5.C FET1.1(G) PWR_JACK.+ R30.2 R69.1 R71.1 U6.55(ACIN) U6.56(ACIN) UART0.5 ; supply symbol labelled 5VEXT
+24V: BAT.1(PP) C85.2 C142.2 LIPO_BAT.1 R35.2 U6.49(BATSENSE) ; supply symbol labelled BAT
ALDO3: C122.2 R64.2(1.2) U6.36(ALDO3)
AXP-NMI#: R56.1 U1.N14(NMI) U6.29(IRQ/WAKEUP)
AXP-RESET#: C80.2 R53.1 R54.1 R55.2 U1.P17(RESET)
AXP_PWRON: C114.2 PWRON/PL11.1 R46.2 U6.12(PWRON)
CHGLED: R42.2 U6.52(CHGLED/MOTORDRV)
DCDC4_OUT: C101.2 DCDC4_OUT.1(PP) L8.1 U6.67(DCDC4)
DLDO1: C125.2 U6.19(DLDO1)
DLDO2: C126.2 U6.17(DLDO2)
DLDO3: C128.2 R63.2(1.2) U6.16(DLDO3)
DLDO4: C129.2 U6.20(DLDO4)
DSI-CKN: CSI/DSI.6 U1.U5(DSI-CKN)
DSI-CKP: CSI/DSI.5 U1.T5(DSI-CKP)
DSI-DN0: CSI/DSI.8 U1.R4(DSI-D0N)
DSI-DN1: CSI/DSI.10 U1.R5(DSI-D1N)
DSI-DN2: CSI/DSI.12 U1.U6(DSI-D2N)
DSI-DN3: CSI/DSI.14 U1.R6(DSI-D3N)
DSI-DP0: CSI/DSI.7 U1.P4(DSI-D0P)
DSI-DP1: CSI/DSI.9 U1.P5(DSI-D1P)
DSI-DP2: CSI/DSI.11 U1.T6(DSI-D2P)
DSI-DP3: CSI/DSI.13 U1.P6(DSI-D3P)
ELDO1: C131.2 U6.68(ELDO1)
ELDO3: C133.2 U6.3(ELDO3)
GND [pwr]: C1.2 C2.1 C3.1 C4.1 C5.1 C7.1 C8.2 C9.2 C10.1 C11.1 C12.1 C13.1 C14.1 C15.1 C16.1 C18.1 C19.1 C21.2 C22.2 C23.1 C24.1 C25.1 C26.1 C27.1 C28.1 C29.1 C30.1 C31.1 C32.1 C33.1 C34.1 C35.1 C36.1 C37.1 C38.1 C39.1 C40.1 C41.1 C42.1 C43.1 C44.1 C45.1 C46.1 C47.1 C48.1 C49.1 C50.1 C51.1 C52.1 C53.1 C54.2 C55.2 C56.2 C57.2 C58.2 C59.2 C60.2 C61.1 C62.1 C63.1 C64.1 C65.1 C66.1 C67.1 C68.1 C69.1 C70.1 C71.2 C72.2 C73.1 C74.2 C75.1 C76.1 C77.1 C78.1 C79.1 C80.1 C81.1 C83.1 C86.1 C89.1 C94.1 C96.1 C98.1 C99.1 C100.1 C101.1 C102.1 C103.1 C104.1 C105.1 C106.1 C107.1 C108.1 C109.1 C110.1 C111.2 C112.1 C113.1 C114.1 C116.1 C117.1 C118.1 C119.1 C122.1 C124.1 C125.1 C126.1 C127.1 C128.1 C129.1 C130.1 C131.1 C132.1 C133.1 C134.1 C135.1 C136.1 C137.1 C138.2 C139.2 C140.2 C141.1 C142.1 CSI/DSI.4 CSI/DSI.18 CSI/DSI.37 D5.A GND.1(PP) GND_PIN.P$1(PP) GPIO.2 HSIC-GND.1(PP) L3.1 LCD.2 LCD.4 LED1.C LIPO_BAT.2 MIC.2 MICRO_SD.6(VSS) PWR.C PWR_BUT.2_1 PWR_JACK.- PWR_JACK.-- R7.1 R16.2 R19.1 R20.1 R21.1 R22.1 R23.2 R25.1 R26.1 R27.1 R28.1 R45.2(1.2) R58.2 R71.2 R72.2 R73.1(1.1) RESET.1_1 U1.F8(GND) U1.F9(GND) U1.F10(GND) U1.G7(GND) U1.G8(GND) U1.G9(GND) U1.G10(GND) U1.G11(GND) U1.H7(GND) U1.H8(GND) U1.H9(GND) U1.H10(GND) U1.H11(GND) U1.H12(GND) U1.J7(GND) U1.J8(GND) U1.J9(GND) U1.J10(GND) U1.J11(GND) U1.J12(GND) U1.K7(GND) U1.K8(GND) U1.K9(GND) U1.K10(GND) U1.K11(GND) U1.K12(GND) U1.L8(GND) U1.L9(GND) U1.L10(GND) U1.L11(GND) U1.M8(VCC-EFUSE) U1.M9(GND) U1.M10(GND) U1.N4(GND) U2.A1(VSS) U2.A8(VSS) U2.B1(VSS) U2.B2(VSSQ) U2.B8(VSSQ) U2.C9(VSSQ) U2.D1(VSSQ) U2.D8(VSS) U2.D9(VSSQ) U2.F2(VSS) U2.F8(VSS) U2.J1(VSS) U2.J9(VSS) U2.L1(VSS) U2.L9(VSS) U2.N1(VSS) U2.N9(VSS) U3.A1(VSS) U3.A8(VSS) U3.B1(VSS) U3.B2(VSSQ) U3.B8(VSSQ) U3.C9(VSSQ) U3.D1(VSSQ) U3.D8(VSS) U3.D9(VSSQ) U3.F2(VSS) U3.F8(VSS) U3.J1(VSS) U3.J9(VSS) U3.L1(VSS) U3.L9(VSS) U3.N1(VSS) U3.N9(VSS) U4.2(NC) U4.13(VSS) U4.23(NC) U4.25(NC) U4.36(VSS) U4.48(NC) U5.2(GND) U6.6(PGND5) U6.10(DC5SET) U6.15(PGND1) U6.26(PGND2) U6.27(PGND2) U6.42(PGND3) U6.59(PGND_CHG) U6.66(PGND4) U6.GND1(GND) U6.GND2(GND) U6.GND3(GND) U6.GND4(GND) U6.GND5(GND) U6.GND(EP_GND) U7.2(GND) UART0.3 UART0.4 USB_OTG.GND
GNDA: C17.2 C82.1 C84.2 C87.1 C88.1 C90.1 C91.1 C92.1 C95.1 C97.1 GPIO.4 R41.2 R73.2(1.2) U1.H13(AGND) UBOOT.1
HBIAS: C130.2 U1.J14(HBIAS)
HPCOM: L11.1 R62.1(1.1) R67.2 U1.H14(HPCOM)
HPCOMFB: R62.2(1.2) U1.H16(HPCOMFB)
HPOUTL: L12.1 R68.2 U1.J17(HPOUTL)
HPOUTR: L10.1 R65.2 U1.J16(HPOUTR)
HPVCCIN: C87.2 R33.2 U1.K13(HPVCCIN)
HSIC-DAT: HSIC-DAT.1(PP) U1.U15(HSIC-DAT)
HSIC-STR: HSIC-STR.1(PP) U1.T15(HSIC-STR)
IPSOUT: C78.2 C79.2 C81.2 C86.2 C99.2 C100.2 C103.2 C109.2 C116.2 C124.2 C141.2 CHGLED.A CSI/DSI.2 IPSOUT.1(PP) L13.1 T1.4(S) T1.8(S1) U6.9(VIN5) U6.13(VIN1) U6.18(DLDOIN) U6.23(VIN2) U6.33(ALDOIN) U6.39(VIN3) U6.53(IPSOUT) U6.54(IPSOUT) U6.62(VIN_CHG) U6.63(VIN_CHG) U6.64(VIN4) U7.5(IN)
LCD_CLK: LCD.31 U1.U8(PD24/LCD-CLK/LVDS-VPC)
LCD_D2: LCD.21 LCD.22 LCD.23 U1.R12(PD2/LCD-D2/SDC1-CLK)
LCD_D3: LCD.24 U1.P12(PD3/LCD-D3/SDC1-CMD)
LCD_D4: LCD.25 U1.R11(PD4/LCD-D4/SDC1-D0)
LCD_D5: LCD.26 U1.P11(PD5/LCD-D5/SDC1-D1)
LCD_D6: LCD.27 U1.R10(PD6/LCD-D6/SDC1-D2)
LCD_D7: LCD.28 U1.P10(PD7/LCD-D7/SDC1-D3)
LCD_D10: LCD.13 LCD.14 LCD.15 U1.R9(PD10/LCD-D10/UART1-TX)
LCD_D11: LCD.16 U1.P9(PD11/LCD-D11/UART1-RX)
LCD_D12: LCD.17 U1.R8(PD12/LCD-D12/UART1-RTS)
LCD_D13: LCD.18 U1.P8(PD13/LCD-D13/UART1-CTS)
LCD_D14: LCD.19 U1.R7(PD14/LCD-D14)
LCD_D15: LCD.20 U1.P7(PD15/LCD-D15)
LCD_D18: LCD.5 LCD.6 LCD.7 U1.U11(PD18/LCD-D18/LVDS-VP0)
LCD_D19: LCD.8 U1.T11(PD19/LCD-D19/LVDS-VN0)
LCD_D20: LCD.9 U1.U10(PD20/LCD-D20/LVDS-VP1)
LCD_D21: LCD.10 U1.T10(PD21/LCD-D21/LVDS-VN1)
LCD_D22: LCD.11 U1.U9(PD22/LCD-D22/LVDS-VP2)
LCD_D23: LCD.12 U1.T9(PD23/LCD-D23/LVDS-VN2)
LCD_DE: LCD.32 U1.T8(PD25/LCD-DE/LVDS-VNC)
LCD_HSYNC: LCD.29 U1.U7(PD26/LCD-HSYNC/LVDS-VP3)
LCD_VSYNC: LCD.30 U1.T7(PD27/LCD-VSYNC/LVDS-VN3)
LINEINL: LINEINL.1(PP) U1.H15(LINEINL)
LINEINR: LINEINR.1(PP) U1.J15(LINEINR)
LRADC0: C17.1 GPIO.6 R15.2 R74.1 U1.L14(LRADC0)
MBIAS: C111.1 R47.2 U1.K14(MBIAS)
MIC1N: C123.2 U1.M16(MIC1N)
MIC1P: C115.2 U1.M17(MIC1P)
MIC2N: MIC2N.1(PP) U1.N16(MIC2N)
MIC2P: MIC2P.1(PP) U1.N17(MIC2P)
N0RBX: R6.2 R8.1 U4.6(NC)
N$1: R59.2 U6.11(N_VBUSEN)
N$2: R26.2 U1.R3(DZQ)
N$3: R19.2 U2.H8(ZQ)
N$4: L4.2 U6.14(LX1)
N$5: R21.2 U3.H8(ZQ)
N$6: L3.2 USB_OTG.GND1 USB_OTG.GND2 USB_OTG.GND3 USB_OTG.GND4
N$7: D1.C UART0.2
N$8: R17.2 U1.G1(DCK)
N$9: R18.2 U1.G2(DCKB)
N$10: R66.2 U1.F16(PB3/UART2-CTS/PB-EINT3)
N$11: R28.2 U5.3(ISET)
N$12: C55.1 L2.2 U5.1(OUT)
N$13: R22.2 U3.H9(NC/ZQ1)
N$14 [pwr]: R45.1(1.1) U6.30(TS)
N$15: T1.3(G) U6.51(N_BATDRV)
N$16: C104.2 U6.47(VINT)
N$17: C85.1 C89.2 C93.2 R35.1 R40.2 T1.1(D) T1.2(D1) T1.5(D2) T1.6(D3) T1.7(D4) U6.50(LOADSENSE) U6.58(CHSENSEN)
N$18: L7.1 U6.60(LX_CHG) U6.61(LX_CHG)
N$19: C88.2 C90.2 U1.H17(HPVCCBP)
N$20 [pwr]: LCD.3 LCD_VCC.2
N$21: C93.1 C96.2 C98.2 L7.2 R40.1 U6.57(CHSENSEP)
N$22: C105.2 U6.35(VREF)
N$23: C140.1 D4.K(C) FET1.3(D) R70.2
N$24: R55.1 RESET.2_1
N$25: LCD.37 R36.1(1.1)
N$26: LCD.39 R38.1(1.1)
N$27: LCD.38 R37.2(1.2)
N$28: C91.2 U1.K16(VRA1)
N$29: LCD.40 R39.2(1.2)
N$30: L5.2 U6.24(LX2) U6.25(LX2)
N$31 [pwr]: C82.2 C84.1 R34.2 U1.L16(AVCC)
N$32: L6.2 U6.40(LX3) U6.41(LX3)
N$33: C123.1 C127.2 MIC.1 R57.2 R77.1
N$34: C137.2 R68.1
N$35: L8.2 U6.65(LX4)
N$36: C136.2 R67.1
N$37: L9.2 U6.7(LX5) U6.8(LX5)
N$38: PWR_BUT.1_1 R46.1
N$39: R74.2 UBOOT.2
N$40: HEADPHONES.2 L11.2
N$41: HEADPHONES.1 L12.2
N$42: C71.1 U1.M13(RTCVIO)
N$43: CHGLED.C R42.1
N$44: C135.2 R65.1
N$45: HEADPHONES.3 L10.2
N$46: C112.2 C115.1 MIC.3 R52.2 R77.2
N$47: C120.2 R47.1 R52.1
N$48: C120.1 R57.1 R58.1
N$49: R20.2 U2.H9(NC/ZQ1)
N$50: C18.2 C19.2 C20.2 C26.2 R24.1 R25.2 U2.E1(VREFDQ) U2.J8(VREFCA) U3.E1(VREFDQ) U3.J8(VREFCA)
N$51: GPIO.20 PWRON/PL11.2
N$52: 32KHZFOUT.1(PP) U1.R15(X32KFOUT)
N$58: MICRO_SD.10(PACK1) MICRO_SD.11(PACK2) MICRO_SD.12(PACK3) MICRO_SD.13(PACK4) R23.1
N$86: C68.2 Q2.4 R75.1 U1.R17(X32KIN)
N$116: C69.2 Q2.1 R75.2 U1.R16(X32KOUT)
N$122: C95.2 C97.2 U1.L17(VRP)
N$123: D4.A L13.2 U7.1(LX)
N$126: R70.1 R72.1 U7.3(FB)
N$129: PWR.A R69.2
N$134: C70.2 R30.1
N$135: C75.2 R31.1
N$176: C92.2 R41.1 U1.K17(VRA2)
N$231: LED1.A R2.2
NWP: C14.2 R14.2 U4.19(#WP)
PB0/UART0-TX: U1.G17(PB0/UART2-TX/UART0-TX/PB-EINT0) UART0.1
PB1/UART0-RX: D1.A R1.1 U1.G16(PB1/UART2-RX/UART0-RX/PB-EINT1)
PB2/LCD_PWR: LCD.35 U1.F17(PB2/UART2-RTS/PB-EINT2)
PB7/LED: R2.1 U1.F15(PB7/PCM0-DIN/AIF2-DIN/PB-EINT7)
PC0/N0WE: U1.D12(PC0/NAND-WE/SPI0-MOSI) U4.18(#WE)
PC1/N0ALE: U1.C12(PC1/NAND-ALE/SPI0-MISO) U4.17(ALE)
PC2/N0CLE: U1.C11(PC2/NAND-CLE/SPI0-CLK) U4.16(CLE)
PC3/N0CE1: U1.D11(PC3/NAND-CE1/SPI0-CS) U4.10(NC)
PC4/N0CE0: U1.B11(PC4/NAND-CE0) U4.9(#CE)
PC5/N0RE: U1.C10(PC5/NAND-RE/SDC2-CLK) U4.8(#RE)
PC6/N0RB0: R3.2 R8.2 U1.D10(PC6/NAND-RB0/SDC2_CMD) U4.7(R/#B)
PC7/N0RB1: R4.2 R6.1 U1.A12(PC7/NAND-RB1) U4.4(NC) U4.5(NC)
PC8/N0DQ0: U1.A11(PC8/NAND-DQ0/SDC2-D0) U4.29(I/O0)
PC9/N0DQ1: U1.B10(PC9/NAND-DQ1/SDC2_D1) U4.30(I/O1)
PC10/N0DQ2: U1.A10(PC10/NAND-DQ2/SDC2-D2) U4.31(I/O2)
PC11/N0DQ3: U1.B9(PC11/NAND-DQ3/SDC2-D3) U4.32(I/O3)
PC12/N0DQ4: U1.A9(PC12/NAND-DQ4/SDC2-D4) U4.41(I/O4)
PC13/N0DQ5: U1.B8(PC13/NAND-DQ5/SDC2-D5) U4.42(I/O5)
PC14/N0DQ6: U1.A8(PC14/NAND-DQ6/SDC2-D6) U4.43(I/O6)
PC15/N0DQ7: U1.B7(PC15/NAND-DQ7/SDC2-D7) U4.44(I/O7)
PC16/N0DQS: U1.A7(PC16/NAND-DQS/SDC2-RST) U4.35(NC)
PE0/CSI-PCLK: CSI/DSI.36 U1.C5(PE0/CSI-PCLK)
PE1/CSI-MCLK: CSI/DSI.35 U1.D5(PE1/CSI-MCLK)
PE2/CSI-HSYNC: CSI/DSI.34 U1.C6(PE2/CSI-HSYNC)
PE3/CSI-VSYNC: CSI/DSI.33 U1.D6(PE3/CSI-VSYNC)
PE4/CSI-D0: CSI/DSI.32 U1.A6(PE4/CSI-D0)
PE5/CSI-D1: CSI/DSI.31 U1.B6(PE5/CSI-D1)
PE6/CSI-D2: CSI/DSI.30 U1.A5(PE6/CSI-D2)
PE7/CSI-D3: CSI/DSI.29 U1.B5(PE7/CSI-D3)
PE8/CSI-D4: CSI/DSI.28 U1.A4(PE8/CSI-D4)
PE9/CSI-D5: CSI/DSI.27 U1.B4(PE9/CSI-D5)
PE10/CSI-D6: CSI/DSI.26 U1.A3(PE10/CSI-D6)
PE11/CSI-D7: CSI/DSI.25 U1.B3(PE11/CSI-D7)
PE12/CSI-SCK: CSI/DSI.24 U1.A2(PE12/CSI-SCK/TWI2-SCK)
PE13/CSI-SDA: CSI/DSI.23 U1.B2(PE13/CSI-SDA/TWI2-SDA)
PE14/CSI-STBY-R: CSI/DSI.22 U1.C3(PE14)
PE15/CSI-RST-R: CSI/DSI.21 U1.D3(PE15)
PE16/CSI-STBY-F: CSI/DSI.20 U1.C4(PE16)
PE17/CSI-RST-F: CSI/DSI.19 U1.D4(PE17)
PG0: GPIO.13 U1.A15(PG0/SDC1-CLK/PG-EINT0)
PG1: GPIO.15 U1.B15(PG1/SDC1-CMD/PG-EINT1)
PG2: GPIO.17 U1.A14(PG2/SDC1-D0/PG-EINT2)
PG3: GPIO.19 U1.B14(PG3/SDC1-D1/PG-EINT3)
PG4: GPIO.21 U1.A13(PG4/SDC1-D2/PG-EINT4)
PG5: GPIO.23 U1.B13(PG5/SDC1-D3/PG-EINT5)
PG6: GPIO.25 U1.A17(PG6/UART1-TX/PG-EINT6)
PG7: GPIO.27 U1.B17(PG7/UART1-RX/PG-EINT7)
PG8: GPIO.29 U1.A16(PG8/URAT1-RTS/PG-EINT8)
PG9: GPIO.31 U1.B16(PG9/UART1-CTS/PG-EINT9)
PG10: GPIO.33 U1.C17(PG10/PCM1-SYNC/AIF3-SYNC/PG-EINT10)
PG11: GPIO.35 U1.C16(PG11/PCM1-CLK/AIF3-BCLK/PG-EINT11)
PG12: GPIO.37 U1.C15(PG12/PCM1-DOUT/AIF3-DOUT/PG-EINT12)
PG13: GPIO.39 U1.C14(PG13/PCM1-DIN/AIF3-DIN/PG-EINT13)
PH0/PWM0: GPIO.40 LCD.36 U1.D17(PH0/PWM0)
PH1/PWM1: GPIO.38 U1.D16(PH1/PWM1)
PH2/TWI0-SCK(TP): GPIO.36 R38.2(1.2) R43.2 R48.1 U1.D15(PH2/TWI0-SCK)
PH3/TWI0-SDA(TP): GPIO.34 R39.1(1.1) R44.1 R49.1 U1.D14(PH3/TWI0-SDA)
PH4/TWI1_SCK: GPIO.32 R50.1 U1.D13(PH4/TWI1-SCK)
PH5/TWI1_SDA: GPIO.30 R51.1 U1.C13(PH5/TWI1-SDA)
PH6: GPIO.28 U1.E17(PH6/SPI0-CS/UART3-TX)
PH7: GPIO.26 U1.E16(PH7/SPI0-CLK/UART3-RX)
PH8: GPIO.24 U1.E15(PH8/SPI0-MOSI/UART3-RTS)
PH9: GPIO.22 U1.E14(PH9/SPI0-MISO/UART3-CTS)
PHINN: PHINN.1(PP) U1.K15(PHONEINN)
PHINP: PHINP.1(PP) U1.L15(PHONEINP)
PHOUTN: PHOUTN.1(PP) U1.N15(PHONEOUTN)
PHOUTP: PHOUTP.1(PP) U1.M15(PHONEOUTP)
PL0/PMU-SCK: GPIO.8 R61.2 U1.P16(PL0/S-RSB-SCK/S-TWI-SCK/S-PL-EINT0) U6.44(SCK)
PL1/PMU-SDA: GPIO.10 R60.2 U1.P15(PL1/S-RSB-SDA/S-TWI-SDA/S-PL-EINT1) U6.45(SDA)
PL2: GPIO.12 U1.U14(PL2/S-UART-TX/S-PL-EINT2)
PL3: GPIO.14 U1.T14(PL3/S-UART-RX/S-PL-EINT3)
PL4: GPIO.16 U1.R14(PL4/S-JTAG-MS/S-PL-EINT4)
PL5: GPIO.18 U1.P14(PL5/S-JTAG-CK/S-PL-EINT5)
PL6/LCD_LR: LCD.33 U1.U13(PL6/S-JTAG-DO/S-PL-EINT6)
PL7/LCD_UD: LCD.34 U1.T13(PL7/S-JTAG-DI/S-PL-EINT7)
PL8/DSI-EN: CSI/DSI.15 U1.R13(PL8/S-TWI-SCK/S-PL-EINT8)
PL9/DSI-RST: CSI/DSI.16 U1.P13(PL9/S-TWI-SDA/S-PL-EINT9)
PL10/S-PWM: CSI/DSI.17 U1.U12(PL10/S-PWM/S-PL-EINT10)
PL11: PWRON/PL11.3 U1.T12(PL11/S-PL-EINT11)
PWROK: R54.2 U6.43(PWROK)
S0BA0: U1.J3(DBA0) U2.J2(BA0) U3.J2(BA0)
S0BA1: U1.K4(DBA1) U2.K8(BA1) U3.K8(BA1)
S0BA2: U1.H4(DBA2) U2.J3(BA2) U3.J3(BA2)
S0CASN: U1.M3(DCAS) U2.G3(#CAS) U3.G3(#CAS)
S0CKE0: U1.J4(DCKE) U2.G9(CKE) U3.G9(CKE)
S0CKE1: U1.N7(DCKE1) U2.F9(NC/CKE1) U3.F9(NC/CKE1)
S0CLK: R11.1 R17.1 U2.F7(CK) U3.F7(CK)
S0CLKN: R11.2 R18.1 U2.G7(#CK) U3.G7(#CK)
S0DDR3_RST: R12.2 U1.G3(DRST) U2.N2(#RESET) U3.N2(#RESET)
S0DQ0: U1.M1(DQ0) U2.E8(DQ5)
S0DQ1: U1.M2(DQ1) U2.C8(DQ3)
S0DQ2: U1.L1(DQ2) U2.C7(DQ1)
S0DQ3: U1.L2(DQ3) U2.E7(DQ7)
S0DQ4: U1.J1(DQ4) U2.E3(DQ4)
S0DQ5: U1.J2(DQ5) U2.B3(DQ0)
S0DQ6: U1.H1(DQ6) U2.D2(DQ6)
S0DQ7: U1.H2(DQ7) U2.C2(DQ2)
S0DQ8: U1.U3(DQ8) U3.C8(DQ3)
S0DQ9: U1.U1(DQ9) U3.E8(DQ5)
S0DQ10: U1.U2(DQ10) U3.C7(DQ1)
S0DQ11: U1.T2(DQ11) U3.E7(DQ7)
S0DQ12: U1.R2(DQ12) U3.E3(DQ4)
S0DQ13: U1.P1(DQ13) U3.B3(DQ0)
S0DQ14: U1.P2(DQ14) U3.C2(DQ2)
S0DQ15: U1.N1(DQ15) U3.D2(DQ6)
S0ODT0: U1.L3(DODT) U2.G1(ODT) U3.G1(ODT)
S0ODT1: U1.L7(DODT1) U2.F1(NC/ODT1) U3.F1(NC/ODT1)
S0RASN: U1.L4(DRAS) U2.F3(#RAS) U3.F3(#RAS)
S0SA0: U1.E4(DA0) U2.K3(A0) U3.K3(A0)
S0SA1: U1.D1(DA1) U2.L7(A1) U3.L7(A1)
S0SA2: U1.F2(DA2) U2.L3(A2) U3.L3(A2)
S0SA3: U1.H3(DA3) U2.K2(A3) U3.K2(A3)
S0SA4: U1.D2(DA4) U2.L8(A4) U3.L8(A4)
S0SA5: U1.F1(DA5) U2.L2(A5) U3.L2(A5)
S0SA6: U1.A1(DA6) U2.M8(A6) U3.M8(A6)
S0SA7: U1.G4(DA7) U2.M2(A7) U3.M2(A7)
S0SA8: U1.B1(DA8) U2.N8(A8) U3.N8(A8)
S0SA9: U1.F4(DA9) U2.M3(A9) U3.M3(A9)
S0SA10: U1.E2(DA10) U2.H7(A10/AP) U3.H7(A10/AP)
S0SA11: U1.C2(DA11) U2.M7(A11) U3.M7(A11)
S0SA12: U1.E1(DA12) U2.K7(A12/#BC) U3.K7(A12/#BC)
S0SA13: U1.F3(DA13) U2.N3(A13) U3.N3(A13)
S0SA14: U1.C1(DA14) U2.N7(A14) U3.N7(A14)
S0SA15: U1.E3(DA15) U2.J7(NC/A15) U3.J7(NC/A15)
S0SCS0: U1.N3(DCS) U2.H2(#CS) U3.H2(#CS)
S0SCS1: U1.N5(DCS1) U2.H1(NC/#CS1) U3.H1(NC/#CS1)
S0SDQM0: U1.N2(DQM0) U2.B7(DM/TDQS)
S0SDQM1: U1.T3(DQM1) U3.B7(DM/TDQS)
S0SDQS0: U1.K2(DQS0) U2.C3(DQS)
S0SDQS0_N: U1.K1(DQS0B) U2.D3(#DQS)
S0SDQS1: U1.R1(DQS1) U3.C3(DQS)
S0SDQS1_N: U1.T1(DQS1B) U3.D3(#DQS)
S0VREF: C6.2 C7.2 C53.2 R5.1 R7.2 U1.M4(DVREF)
S0WEN: U1.K3(DWE) U2.H3(#WE) U3.H3(#WE)
SD0-CLK: MICRO_SD.5(CLK/SCLK) U1.D8(PF2/SDC0-CLK/UART0-TX) UART0-TX.1(PP)
SD0-CMD: MICRO_SD.3(CMD/DI) R10.1 U1.C8(PF3/SDC0-CMD/JTAG_DO1)
SD0-D0: MICRO_SD.7(DAT0/DO) RM1.2.1 U1.C9(PF1/SDC0-D0/JTAG-DI1)
SD0-D1: MICRO_SD.8(DAT1/RES) RM1.3.1 U1.D9(PF0/SDC0-D1/JTAG-MS1)
SD0-D2: MICRO_SD.1(DAT2/RES) RM1.1.1 U1.C7(PF5/SDC0-D2/JTAG_CK1)
SD0-D3: MICRO_SD.2(CD/DAT3/CS) R9.1 U1.D7(PF4/SDC0-D3/UART0_RX) UART0-RX.1(PP)
SD0-DET#: MICRO_SD.9(CP_E) RM1.4.1 U1.G14(PB4/PCM0-SYNC/AIF2-SYNC/PB-EINT4)
SD_VCC: C13.2 L1.2 MICRO_SD.4(VDD)
TP-INT: R36.2(1.2) U1.G15(PB5/PCM0-CLK/AIF2-BCLK/PB-EINT5)
TP-RST: R37.1(1.1) U1.F14(PB6/PCM0-DOUT/AIF2-DOUT/PB-EINT6)
USB0-DRVVBUS: R27.2 R59.1 U5.4(EN)
USB0-IDDET: R29.2 R66.1 USB_OTG.ID
USB-DM0: U1.T16(USB_DM0) USB_OTG.D-
USB-DM1: GPIO.9 U1.U16(USB_DM1)
USB-DP0: U1.T17(USB_DP0) USB_OTG.D+
USB-DP1: GPIO.11 U1.U17(USB_DP1)
V+: 1.5V.1(PP) C1.1 C2.2 C3.2 C4.2 C5.2 C6.1 C20.1 C27.2 C28.2 C29.2 C30.2 C31.2 C32.2 C33.2 C34.2 C35.2 C36.2 C37.2 C38.2 C39.2 C40.2 C41.2 C42.2 C43.2 C44.2 C45.2 C46.2 C47.2 C48.2 C49.2 C50.2 C51.2 C52.2 C107.2 L9.1 R5.2 R12.1 R24.2 U1.H5(VCC-DRAM) U1.H6(VCC-DRAM) U1.J5(VCC-DRAM) U1.J6(VCC-DRAM) U1.K5(VCC-DRAM) U1.L5(VCC-DRAM) U2.A2(VDD) U2.A9(VDD) U2.B9(VDDQ) U2.C1(VDDQ) U2.D7(VDD) U2.E2(VDDQ) U2.E9(VDDQ) U2.G2(VDD) U2.G8(VDD) U2.K1(VDD) U2.K9(VDD) U2.M1(VDD) U2.M9(VDD) U3.A2(VDD) U3.A9(VDD) U3.B9(VDDQ) U3.C1(VDDQ) U3.D7(VDD) U3.E2(VDDQ) U3.E9(VDDQ) U3.G2(VDD) U3.G8(VDD) U3.K1(VDD) U3.K9(VDD) U3.M1(VDD) U3.M9(VDD) U6.5(DCDC5) ; supply symbol labelled 1.5V
VCC [pwr]: 3.0V.1(PP) C15.2 C16.2 C73.2 C118.2 GPIO.3 L1.1 L4.1 LCD_VCC.1 R1.2 R3.1 R4.1 R9.2 R10.2 R13.1 R14.1 R29.1 R48.2 R49.2 R50.2 R51.2 R60.1 R61.1 RM1.1.2 RM1.2.2 RM1.3.2 RM1.4.2 U1.N6(VCC-DSI) U4.1(NC) U4.12(VCC) U4.24(NC) U4.34(NC) U4.37(VCC) U4.39(NC) U6.1(ELDOIN) U6.21(DCDC1) U7.4(EN) ; supply symbol labelled 3.0V
VCC-LCD(3V0): C76.2 CSI/DSI.3 LCD_VCC.3 U6.22(DC1SW)
VCC-PLL: C74.1 C77.2 R32.1 U1.M5(VCC-PLL)
VCC-RTC: C72.1 GPIO.7 R76.1 U1.M12(VCC-RTC)
VCC-RTC_AXP: C102.2 R53.2 R56.2 R76.2 U6.46(VCC_RTC)
VCC/2: 1.1V_CPU.1(PP) C8.1 C9.1 C10.2 C11.2 C12.2 C94.2 L6.1 U1.E5(VDD-CPU) U1.E6(VDD-CPU) U1.E7(VDD-CPU) U1.F5(VDD-CPU) U1.F6(VDD-CPU) U1.F7(VDD-CPU) U1.G5(VDD-CPU) U1.G6(VDD-CPU) U6.38(DCDC3) ; supply symbol labelled 1.1V_CPU
VDD: 1.1V_SYS.1(PP) C21.1 C22.1 C23.2 C24.2 C25.2 C83.2 C134.2 HSIC-1.1V.1(PP) L5.1 U1.E8(VDD-SYS) U1.E9(VDD-SYS) U1.E10(VDD-SYS) U1.K6(VDD-SYS) U1.L6(VDD-SYS) U1.M6(VDD-SYS) U1.M7(VDD-SYS) U1.N8(VDD-SYS) U1.N9(VDD-SYS) U1.N10(VDD-SYS) U1.N12(VCC-HSIC) U6.28(DCDC2) ; supply symbol labelled 1.1V_SYS
VEE: 2.8V_CSI.1(PP) CSI/DSI.40 R63.1(1.1) ; supply symbol labelled 2.8V_CSI
VPP [pwr]: 3.0VA.1(PP) GPIO.5 R15.1 R32.2 R34.1 R64.1(1.1) ; supply symbol labelled 3.0VA
VPS: R13.2 R16.1 U4.38(NC)
XTALI: C66.2 Q1.2 U1.U4(X24MIN)
XTALO: C67.2 Q1.1 U1.T4(X24MOUT)
Unconnected: HEADPHONES.4 HEADPHONES.5 MIC.4 MIC.5 U2.A3(NC) U2.A7(NF/#TDQS) U3.A3(NC) U3.A7(NF/#TDQS) U4.3(NC) U4.11(NC) U4.14(NC) U4.15(NC) U4.20(NC) U4.21(NC) U4.22(NC) U4.26(NC) U4.27(NC) U4.28(NC) U4.33(NC) U4.40(NC) U4.45(NC) U4.46(NC) U4.47(NC) U7.6(NC)

## Buses
S0SA[0..15]
S0DQ[0..15]
S0BA[0..2],S0CLK,S0CLKN,S0CKE[0..1],S0CASN,S0RASN,S0WEN,S0SDQM[0..1],S0SDQS[0..1],S0SDQS0_N,S0SDQS1_N,S0SDQS2_N,S0SDQS3_N,S0DDR3_RST,S0DDR3_ODT[0..1],S0SCS[0..1]
LCD_D[0..7],LCD_D[8..15],LCD_D[16..23],LCD_HSYNC,LCD_VSYNC,LCD_CLK,LCD_DE
N0DQ[0..7],N0WE,N0ALE,N0CLE,N0CE0,N0CE1,N0RE,N0RB[0..1],N0DQS
DSI-DN[0..3],DSI-DP[0..3],DSI-CKN,DSI-CKP
MBIAS,MIC1N,MIC1P,MIC2N,MIC2P,LINEINR,LINEINL,PHOUTN,PHOUTP,PHINN,PHINP,HBIAS,HPOUTR,HPOUTL,HPCOM,HPCOMFB
PE0/CSI-PCLK,PE1/CSI-MCLK,PE2/CSI-HSYNC,PE3/CSI-VSYNC,PE4/CSI-D0,PE5/CSI-D1,PE6/CSI-D2,PE7/CSI-D3,PE7/CSI-D3,PE8/CSI-D4,PE9/CSI-D5,PE10/CSI-D6,PE11/CSI-D7,PE12/CSI-SCK,PE13/CSI-SDA,PE14/CSI-STBY-R,PE15/CSI-RST-R,PE16/CSI-STBY-F,PE17/CSI-RST-F
PG[0..13]
PH0/PWM0,PH1/PWM1,PH2/TWI0-SCK(TP),PH3/TWI0-SDA(TP),PH4/TWI1_SCK,PH5/TWI1_SDA,PH[6..9],PL0/PMU-SCK,PL1/PMU-SDA,PL[2..3],PL4/LCD_LR,PL5/LCD_UD,PL[6..11]

## Notes on the sheet
- ALLWINNER A33 ANDROID TABLET 1-2 GB DDR3 RAM
- DDR3 RAM BELLEK | 1GByte VE 2 GBYTE
- LED | Debug UART
- NAND Flash -> Option!
- 32Gb (4096M x 8bit)
- TUSLAR | MicroSD-KART
- 8G Bytes NAND Flash
- USB-OTG
- Rs
- Iset = 6800/Rs
- Iset = 1000mA
- ANDROID SİSTEM REGULATORU
- =======================
- The power options are 4:
- =======================
- GENEL GIRIS-CIKIS PORT | 1. 5VEXT via PWR_JACK | 3. +5V_OTG_PWR via USB_OTG
- (External 5VDC power source) | (External 5VDC driven by any USB)
- 2. BAT via LIPO_BAT | 4. +5V via UART0 header
- MONITOR-LCD SOKET | (External 4.2VDC battery) | 5V HARİCİ GÜÇ KAYNAĞI
- VCC-3V0
- 3.0V@800mA
- 5.0V | GND
- 3.3V | GND
- R0 | R1
- R2 | R3
- R4 | R5
- R6 | R7 | 3.0V@600mA
- G0 | G1
- G2 | G3
- G4 | G5
- VDD-SYS
- G6 | G7
- 1.1V@2A
- B0 | B1
- B2 | B3
- B4 | B5
- B6 | B7
- HSYNC | VSYNC
- CLK | DE
- L/R | U/D
- PWRE | BKL
- INT/X1 | RES/X2
- VDD-CPU
- SCL/Y1 | SDA/Y2
- 1.1V@2A
- 3.0V@30mA
- VCC-DRAM
- 1.5V\\1.2V@2A
- 3.3V@100mA
- Audio Out & Mic
- 2.8V@100mA
- 1.1V@100mA
- 3.0V@300mA
- 2.5V@300mA
- CAMERA-CSI/MIPI-LCD-DSI | 3.0V@200mA
- 3.3V@400mA
- 3.3V@200mA
- 2V8@200mA
- 3.3V@100mA
- 1V8@200mA
- Rc
- Rd
- Vout=0.6*(1+Rc/Rd)
- +
- -
- Fiducials:
- LI-ION_BATTERY
- 4.2V

## Library data of the parts
1.1V_CPU 1.1V_SYS 1.5V 2.8V_CSI 3.0V 3.0VA 5VEXT 32KHZFOUT +5V BAT DCDC4_OUT GND GND_PIN HSIC-1.1V HSIC-DAT HSIC-GND HSIC-STR IPSOUT LINEINL LINEINR MIC2N MIC2P PHINN PHINP PHOUTN PHOUTP UART0-RX UART0-TX = gogo:TESTPAD: drill 40mils, diameter 70mils
5V_E = jumper:SJ: SMD solder JUMPER
C1-C120 C122-C142 = rcl:C-EU: CAPACITOR, European symbol
CHGLED LED1 PWR = DOUBLE-SIDE:LED
CSI/DSI GPIO LCD = con-harting-ml:ML40: HARTING
D1 D3 D4 = gogo:SCHOTKKY7.62SS
D5 = OLIMEX_DISCRET:SMBJ16A
FET1 = Penko:P-MOS+DIOD
HEADPHONES MIC = gogo:AUDIO_JACK_3-5PIN
L1-L3 L10-L12 = rcl:L-US: INDUCTOR, American symbol
L4-L9 L13 = OLIMEX_DISCRET:L
LCD_VCC PWRON/PL11 = jumper:SJ2W: SMD solder JUMPER
LIPO_BAT = Penko:CON2
MICRO_SD = OLIMEX_CONNECTORS:MICRO_SD/MMC_CP_NEW
PWR_BUT RESET UBOOT = gogo:SW-TAKT
PWR_JACK = gogo:PWR-JAK
Q1 Q2 = crystal:HC49/S: CRYSTAL
R1-R35 R40-R44 R46-R61 R65-R72 R74-R77 = rcl:R-EU_: RESISTOR, European symbol
R36-R39 R45 R62-R64 R73 = OLIMEX_DISCRET:R_0R
RM1 = OLIMEX_DISCRET:R_MATRIX_4E
T1 = OLIMEX_DISCRET:WPM1481: WPM1481 According to DMP2035UVT.pdf datasheet by Nikolay -12V -6.5A P-CHANNEL Power MOSFET; Vds:-12V; Rds(on) max:0.023? @ Vgs=?4.5V; Descriptions: The WPM1481 is P-Channel enhancement MOS Field Effect Transistor. Uses advanced trench technology and design to provide excellent R DS (ON) with low gate charge. This device is suitable for use in DC-DC conversion, power switch and charging circuit. Standard Product WPM1481 is Pb-free and Halogen-free. Features: -Trench Technology -Supper high density cell design -Excellent ON resistance for higher DC -Extremely Low Threshold Voltage -Small package DFN2*2-6L
U1 = OLIMEX_IC:A33: According to A33 Datasheet release1.0.pdf datasheet by Nikolay The Allwinner A33 is a remarkably power-efficient quad-core tablet processor based on ARM Cortex TM-A7 CPU along with Mali400MP2 GPU architecture. It is also highly competitive in terms of system cost thanks to its high system integration and is capable of delivering excellent user experience while maintaining ultra low power consumption. Main features: CPU architecture: A33 processor packs the most power efficient quad-core Cortex TM-A7 CPU architecture deliver outstanding system performance and impressive battery life experience; Graphic: A33 adopts the extensively implemented and technically mature Mali400MP2 GPU to provide end users with superior experience in web browsing, video playback and games, etc.; OpenGL ES 2.0 and OpenVG 1.1 standards are supported; Video Engine: A33 supports high-definition 1080P video processing and various mainstream video standards such as H.264, VP8, MPEG 1/2/4, JPEG/MJPEG, etc.; Display: A33 supports CPU/RGB/LVDS LCD interface up to 1280x800 resolution. Four-lane MIPI DSI (Display Serial Interface) is integrated as well, supporting MIPI DSI V1.01 and MIPI D-PHY V1.00; Image: A33 supports a parallel CMOS sensor interface up to 5M resolution
U2 U3 = OLIMEX_IC:H5TQ2G83CFR-H9C
U4 = OLIMEX_IC:H27UBG8T2A
U5 = OLIMEX_IC:SY6280
U6 = OLIMEX_IC:AXP221: PMIC Optimized For Multi-Core High-Performance System
U7 = OLIMEX_IC:SY7208
U8-U13 = SparkFunEagle-6-6-07:FIDUCIAL: Fiducial Alignment Points Various fiducial points for machine vision alignment.
UART0 = Penko:CON5
USB_OTG = OLIMEX_CONNECTORS:MINI_USB9